# EAGLE design Satyrr_six_loadcell_pcb (EAGLE 9.6.2)

## Sheet 1 of 6
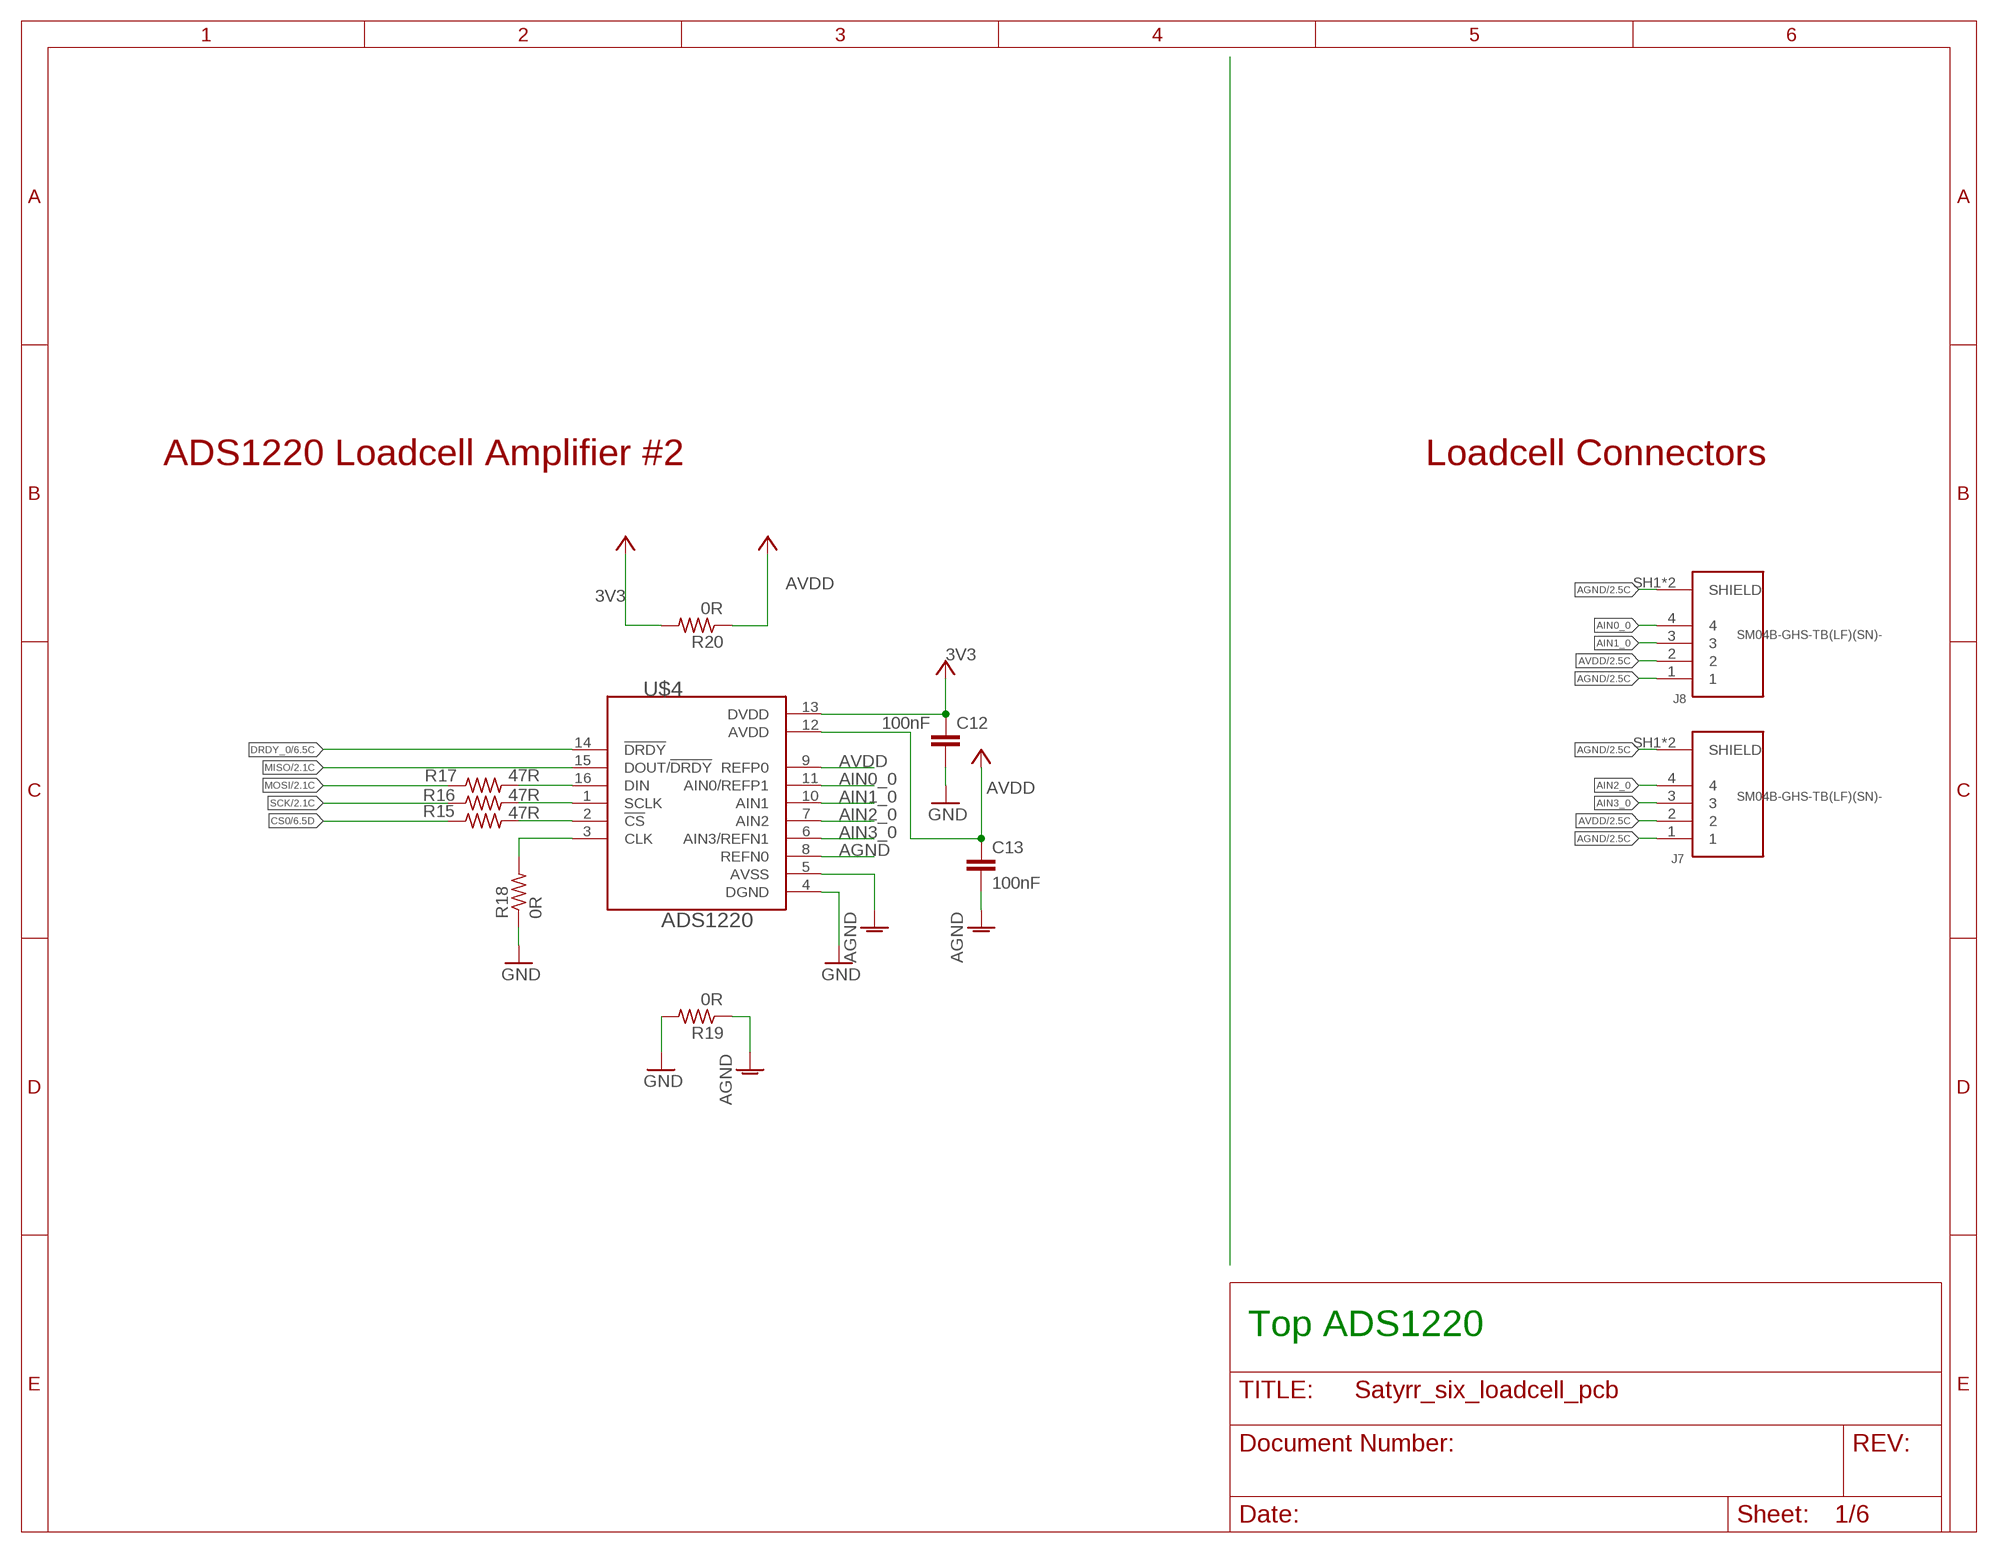
[diagram p0: schematic, sheet 1]

### Parts
C12  100nF  C-EUC0603  [C0603]
C13  100nF  C-EUC0603  [C0603]
J7  SM04B-GHS-TB(LF)(SN)-  [JST_SM04B-GHS-TB(LF)(SN)-]
J8  SM04B-GHS-TB(LF)(SN)-  [JST_SM04B-GHS-TB(LF)(SN)-]
R15  47R  R-US_R0603  [R0603]
R16  47R  R-US_R0603  [R0603]
R17  47R  R-US_R0603  [R0603]
R18  0R  R-US_R0603  [R0603]
R19  0R  R-US_R0603  [R0603]
R20  0R  R-US_R0603  [R0603]
U$4  ADS1220  [TSSOP-16]

### Nets
3V3: C12.1 R20.2 U$4.13(DVDD) ; supply symbol labelled VCC ; also sheet 2,3,4,5,6
AGND: C13.2 J7.1 J7.SH1(SHIELD) J7.SH2(SHIELD) J8.1 J8.SH1(SHIELD) J8.SH2(SHIELD) R19.1 U$4.5(AVSS) U$4.8(REFN0) ; also sheet 2,3
AIN0_0: J8.4 U$4.11(AIN0/REFP1)
AIN1_0: J8.3 U$4.10(AIN1)
AIN2_0: J7.4 U$4.7(AIN2)
AIN3_0: J7.3 U$4.6(AIN3/REFN1)
AVDD: C13.1 J7.2 J8.2 R20.1 U$4.9(REFP0) U$4.12(AVDD) ; supply symbol labelled +5V ; also sheet 2,3
CS0: R15.1 ; also sheet 6
DRDY_0: U$4.14(!DRDY) ; also sheet 6
GND: C12.2 R18.1 R19.2 U$4.4(DGND) ; also sheet 2,3,4,5,6
MISO: U$4.15(DOUT/!DRDY) ; also sheet 2,3,6
MOSI: R17.1 ; also sheet 2,3,6
N$9: R17.2 U$4.16(DIN)
N$10: R16.2 U$4.1(SCLK)
N$11: R15.2 U$4.2(!CS)
N$17: R18.2 U$4.3(CLK)
SCK: R16.1 ; also sheet 2,3,6

### Notes on the sheet
- ADS1220 Loadcell Amplifier #2 | Loadcell Connectors
- Top ADS1220

## Sheet 2 of 6
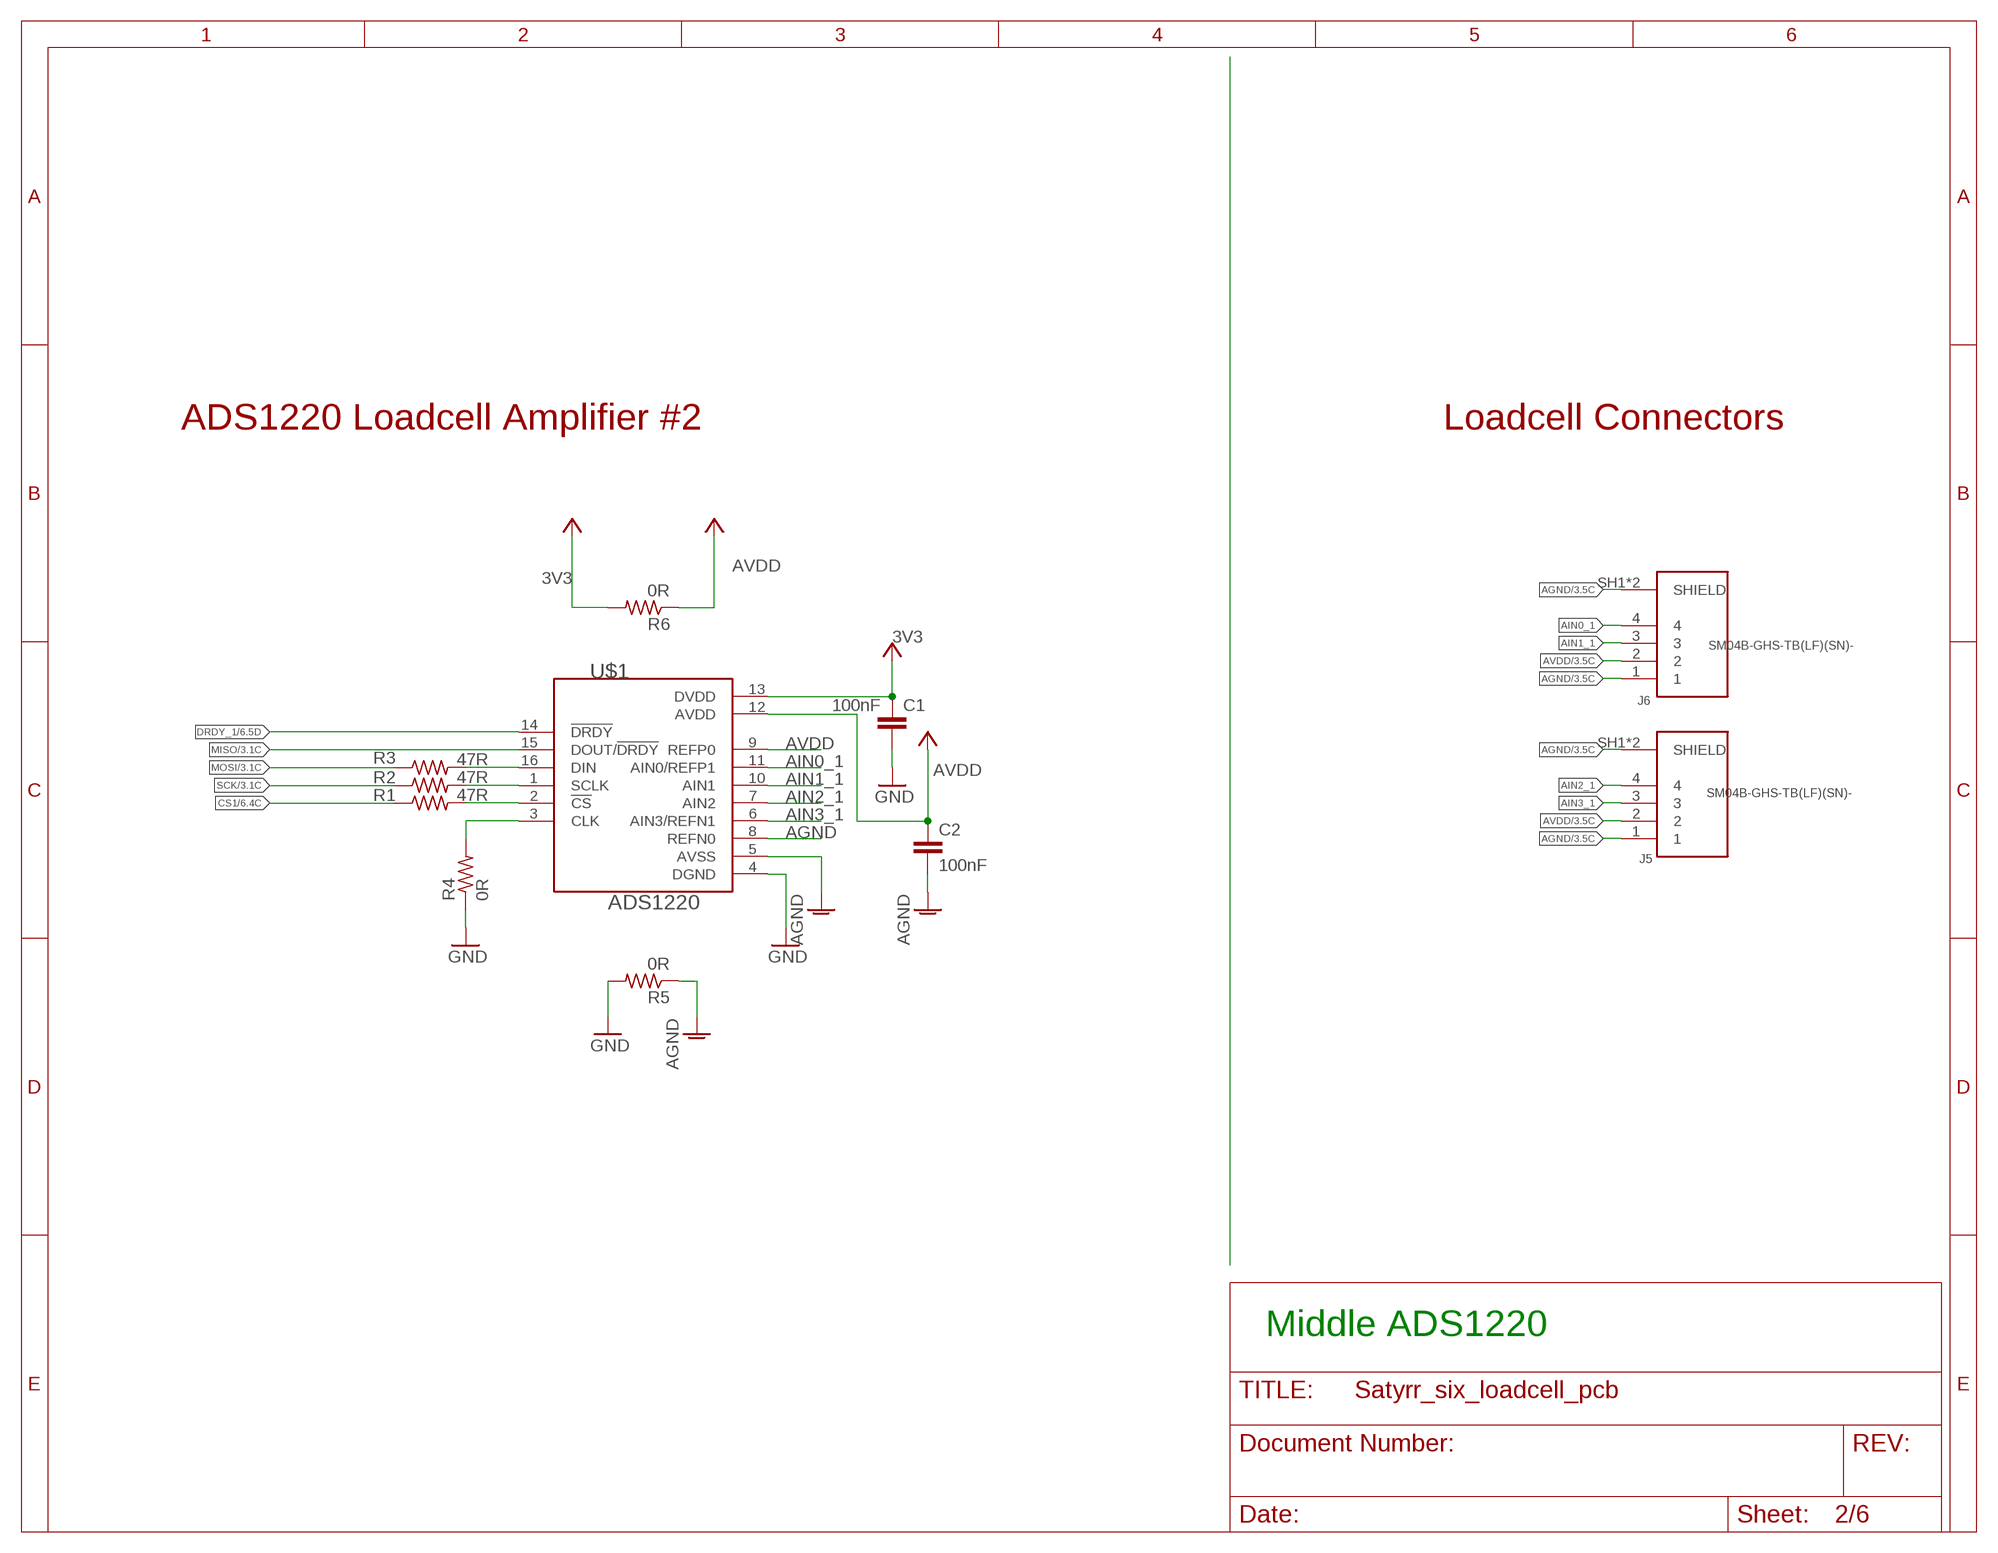
[diagram p1: schematic, sheet 2]

### Parts
C1  100nF  C-EUC0603  [C0603]
C2  100nF  C-EUC0603  [C0603]
J5  SM04B-GHS-TB(LF)(SN)-  [JST_SM04B-GHS-TB(LF)(SN)-]
J6  SM04B-GHS-TB(LF)(SN)-  [JST_SM04B-GHS-TB(LF)(SN)-]
R1  47R  R-US_R0603  [R0603]
R2  47R  R-US_R0603  [R0603]
R3  47R  R-US_R0603  [R0603]
R4  0R  R-US_R0603  [R0603]
R5  0R  R-US_R0603  [R0603]
R6  0R  R-US_R0603  [R0603]
U$1  ADS1220  [TSSOP-16]

### Nets
3V3: C1.1 R6.2 U$1.13(DVDD) ; supply symbol labelled VCC ; also sheet 1,3,4,5,6
AGND: C2.2 J5.1 J5.SH1(SHIELD) J5.SH2(SHIELD) J6.1 J6.SH1(SHIELD) J6.SH2(SHIELD) R5.1 U$1.5(AVSS) U$1.8(REFN0) ; also sheet 1,3
AIN0_1: J6.4 U$1.11(AIN0/REFP1)
AIN1_1: J6.3 U$1.10(AIN1)
AIN2_1: J5.4 U$1.7(AIN2)
AIN3_1: J5.3 U$1.6(AIN3/REFN1)
AVDD: C2.1 J5.2 J6.2 R6.1 U$1.9(REFP0) U$1.12(AVDD) ; supply symbol labelled +5V ; also sheet 1,3
CS1: R1.1 ; also sheet 6
DRDY_1: U$1.14(!DRDY) ; also sheet 6
GND: C1.2 R4.1 R5.2 U$1.4(DGND) ; also sheet 1,3,4,5,6
MISO: U$1.15(DOUT/!DRDY) ; also sheet 1,3,6
MOSI: R3.1 ; also sheet 1,3,6
N$3: R3.2 U$1.16(DIN)
N$4: R2.2 U$1.1(SCLK)
N$5: R1.2 U$1.2(!CS)
N$7: R4.2 U$1.3(CLK)
SCK: R2.1 ; also sheet 1,3,6

### Notes on the sheet
- ADS1220 Loadcell Amplifier #2 | Loadcell Connectors
- Middle ADS1220

## Sheet 3 of 6
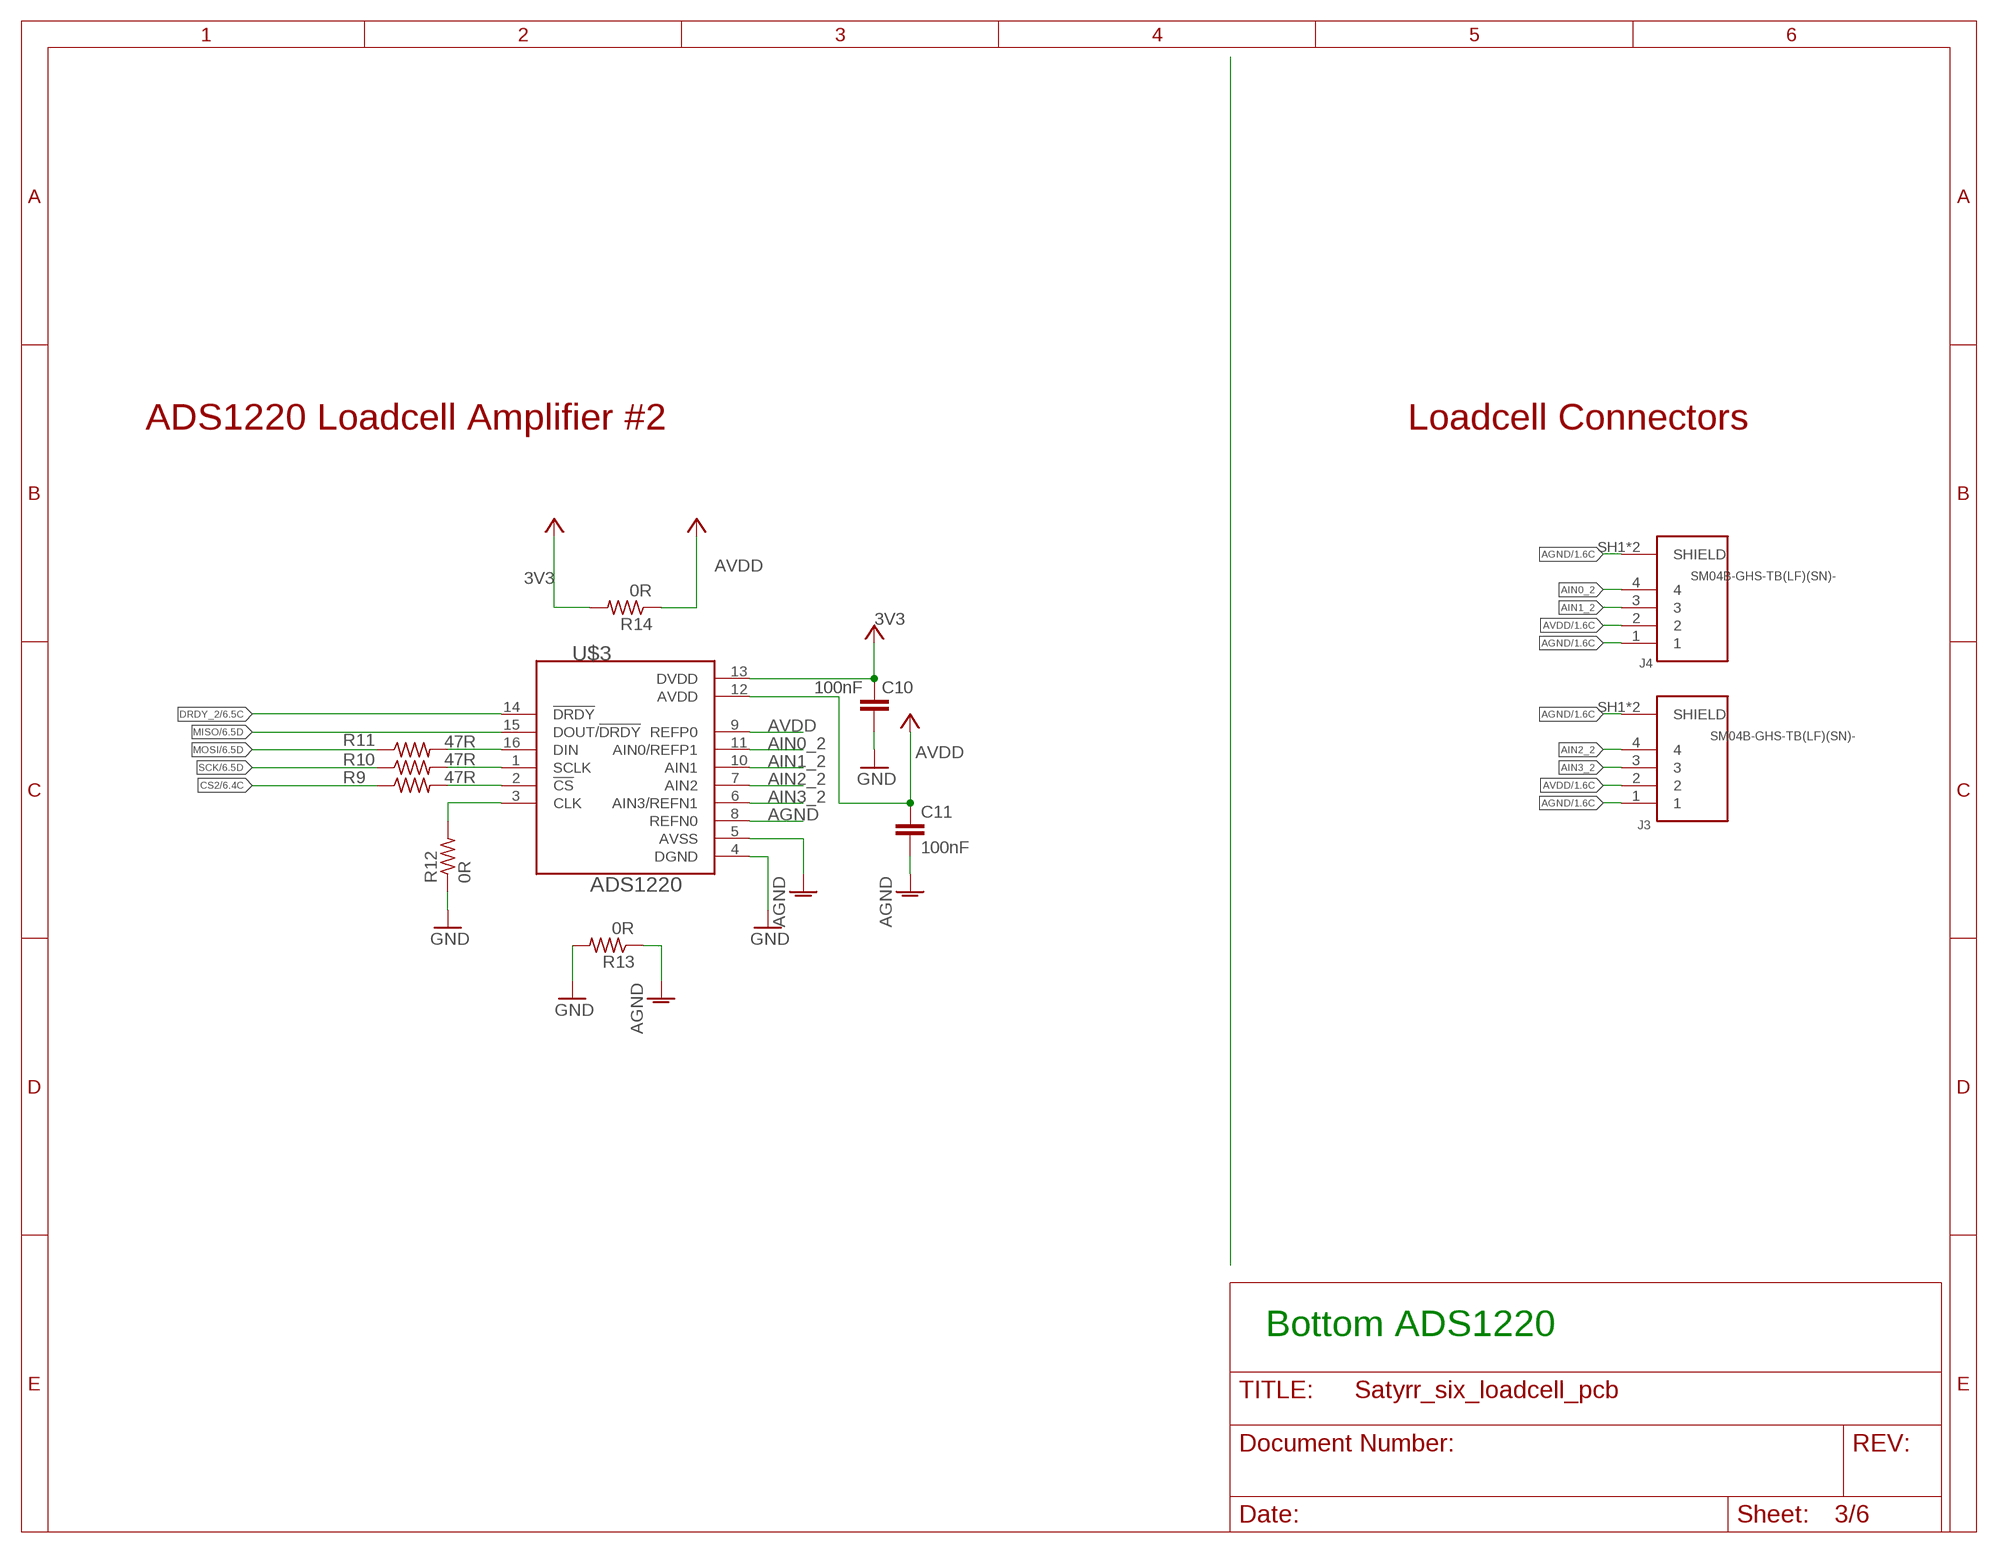
[diagram p2: schematic, sheet 3]

### Parts
C10  100nF  C-EUC0603  [C0603]
C11  100nF  C-EUC0603  [C0603]
J3  SM04B-GHS-TB(LF)(SN)-  [JST_SM04B-GHS-TB(LF)(SN)-]
J4  SM04B-GHS-TB(LF)(SN)-  [JST_SM04B-GHS-TB(LF)(SN)-]
R9  47R  R-US_R0603  [R0603]
R10  47R  R-US_R0603  [R0603]
R11  47R  R-US_R0603  [R0603]
R12  0R  R-US_R0603  [R0603]
R13  0R  R-US_R0603  [R0603]
R14  0R  R-US_R0603  [R0603]
U$3  ADS1220  [TSSOP-16]

### Nets
3V3: C10.1 R14.2 U$3.13(DVDD) ; supply symbol labelled VCC ; also sheet 1,2,4,5,6
AGND: C11.2 J3.1 J3.SH1(SHIELD) J3.SH2(SHIELD) J4.1 J4.SH1(SHIELD) J4.SH2(SHIELD) R13.1 U$3.5(AVSS) U$3.8(REFN0) ; also sheet 1,2
AIN0_2: J4.4 U$3.11(AIN0/REFP1)
AIN1_2: J4.3 U$3.10(AIN1)
AIN2_2: J3.4 U$3.7(AIN2)
AIN3_2: J3.3 U$3.6(AIN3/REFN1)
AVDD: C11.1 J3.2 J4.2 R14.1 U$3.9(REFP0) U$3.12(AVDD) ; supply symbol labelled +5V ; also sheet 1,2
CS2: R9.1 ; also sheet 6
DRDY_2: U$3.14(!DRDY) ; also sheet 6
GND: C10.2 R12.1 R13.2 U$3.4(DGND) ; also sheet 1,2,4,5,6
MISO: U$3.15(DOUT/!DRDY) ; also sheet 1,2,6
MOSI: R11.1 ; also sheet 1,2,6
N$1: R11.2 U$3.16(DIN)
N$2: R10.2 U$3.1(SCLK)
N$6: R9.2 U$3.2(!CS)
N$8: R12.2 U$3.3(CLK)
SCK: R10.1 ; also sheet 1,2,6

### Notes on the sheet
- ADS1220 Loadcell Amplifier #2 | Loadcell Connectors
- Bottom ADS1220

## Sheet 4 of 6
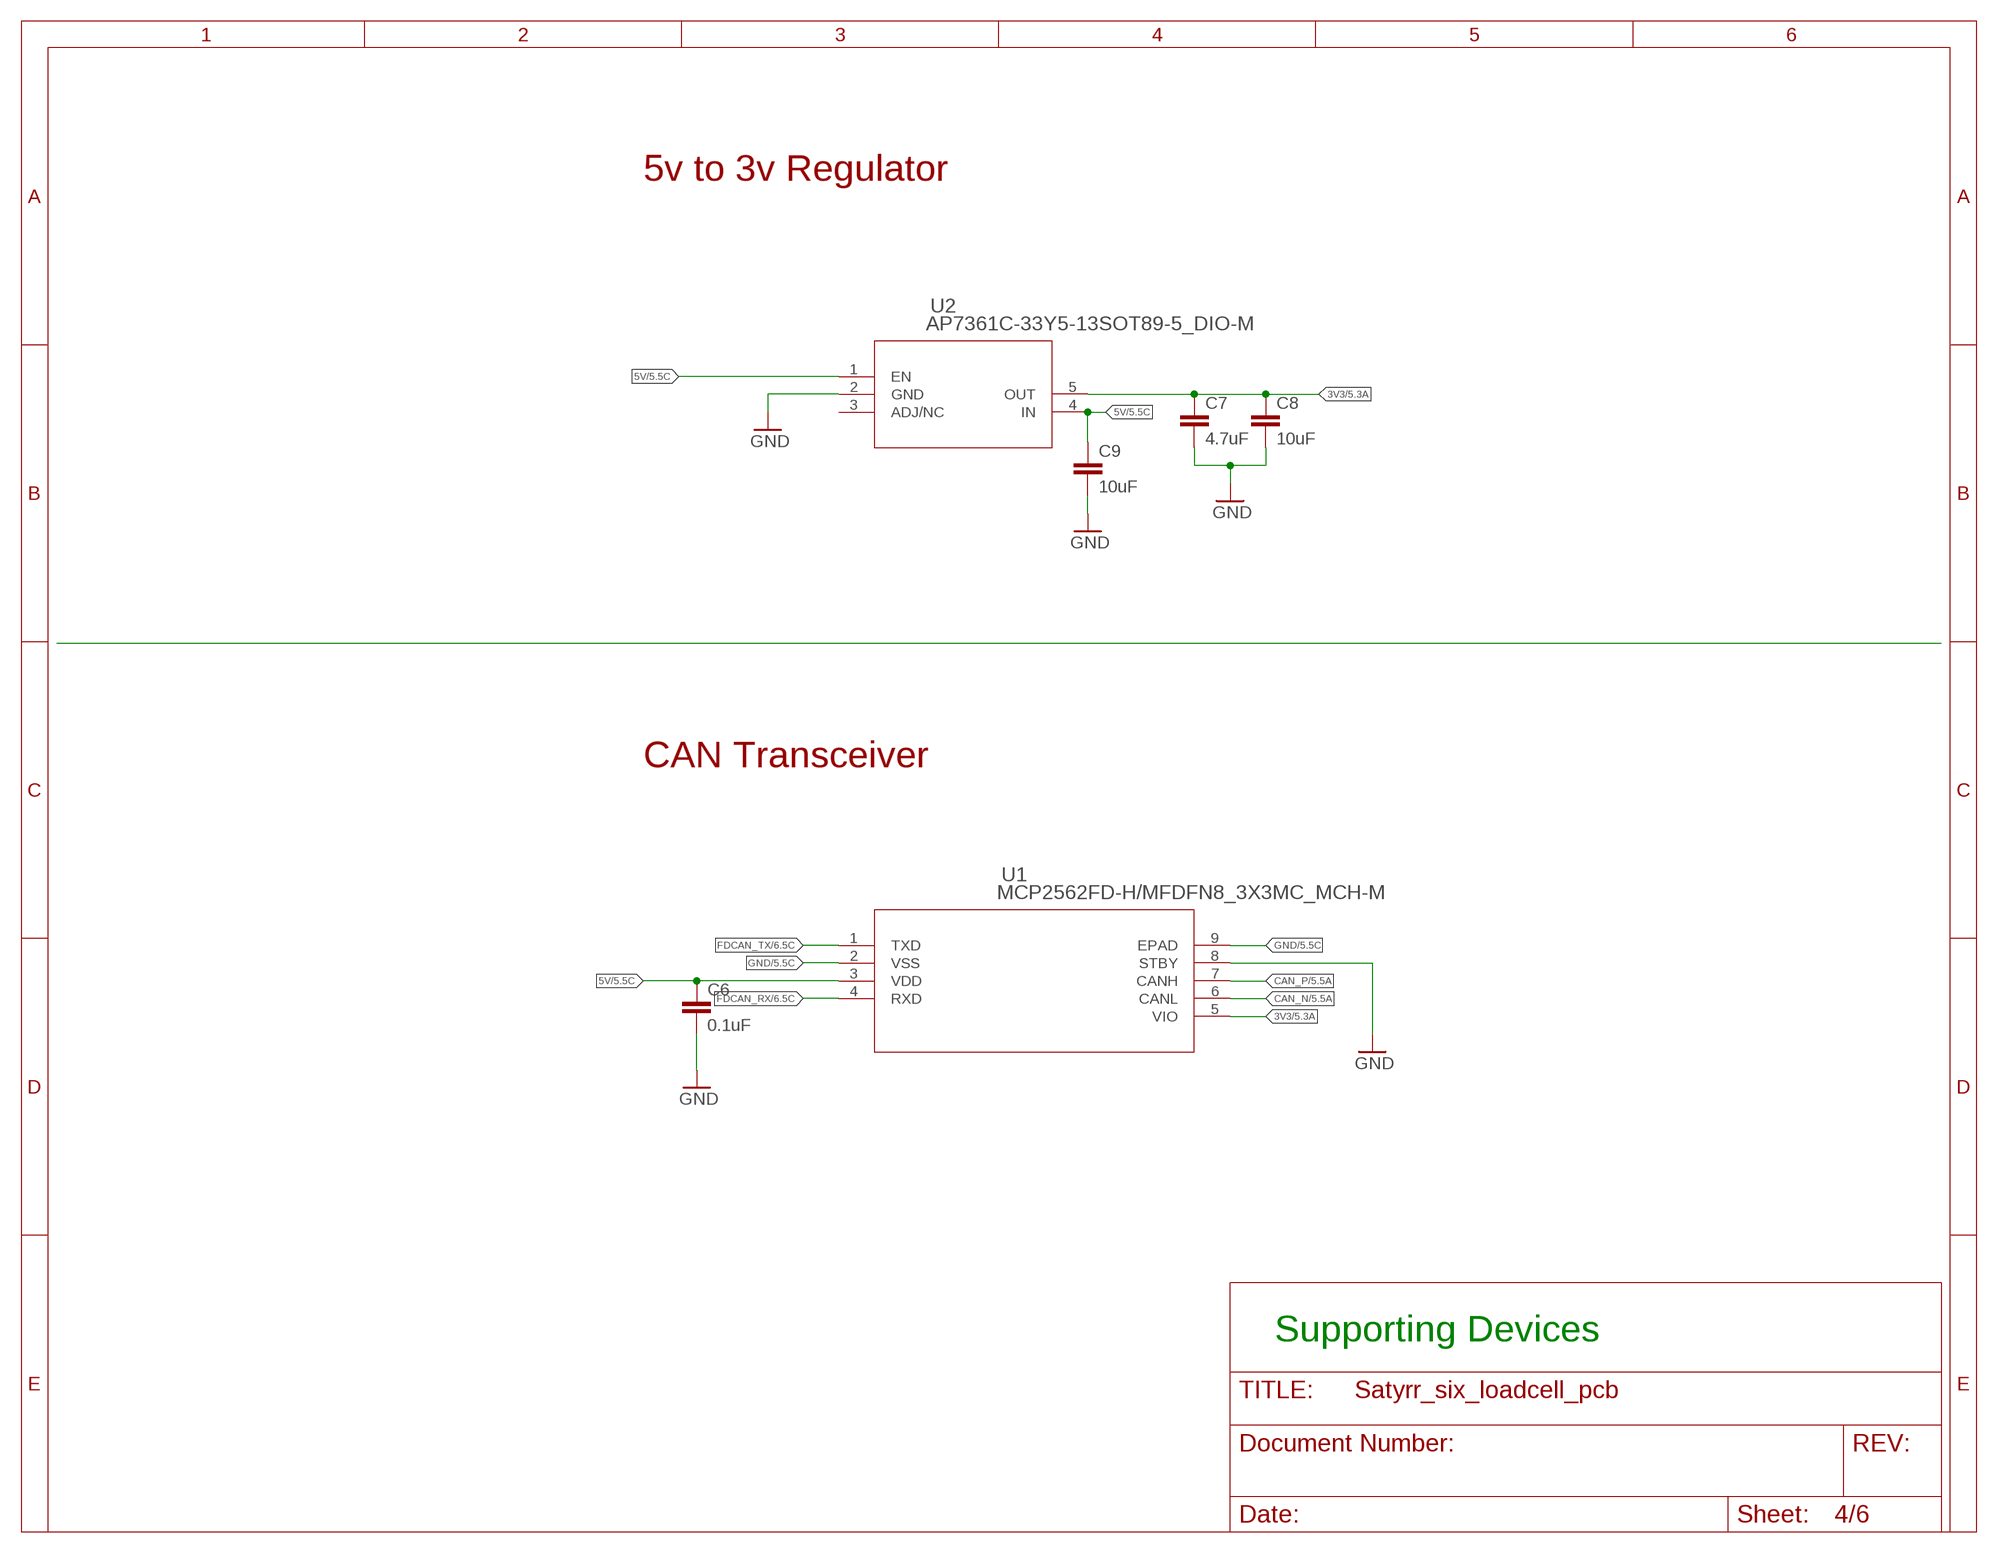
[diagram p3: schematic, sheet 4]

### Parts
C6  0.1uF  C-EUC0603  [C0603]
C7  4.7uF  C-EUC0603  [C0603]
C8  10uF  C-EUC0603  [C0603]
C9  10uF  C-EUC0603  [C0603]
U1  MCP2562FD-H/MFDFN8_3X3MC_MCH-M  [DFN8_3X3MC_MCH-M]
U2  AP7361C-33Y5-13SOT89-5_DIO-M  [SOT89-5_DIO-M]

### Nets
3V3: C7.1 C8.1 U1.5(VIO) U2.5(OUT) ; also sheet 1,2,3,5,6
5V: C6.1 C9.1 U1.3(VDD) U2.1(EN) U2.4(IN) ; also sheet 5
CAN_N: U1.6(CANL) ; also sheet 5
CAN_P: U1.7(CANH) ; also sheet 5
FDCAN_RX: U1.4(RXD) ; also sheet 6
FDCAN_TX: U1.1(TXD) ; also sheet 6
GND: C6.2 C7.2 C8.2 C9.2 U1.2(VSS) U1.8(STBY) U1.9(EPAD) U2.2(GND) ; also sheet 1,2,3,5,6
Unconnected: U2.3(ADJ/NC)

### Notes on the sheet
- 5v to 3v Regulator
- CAN Transceiver
- Supporting Devices

## Sheet 5 of 6
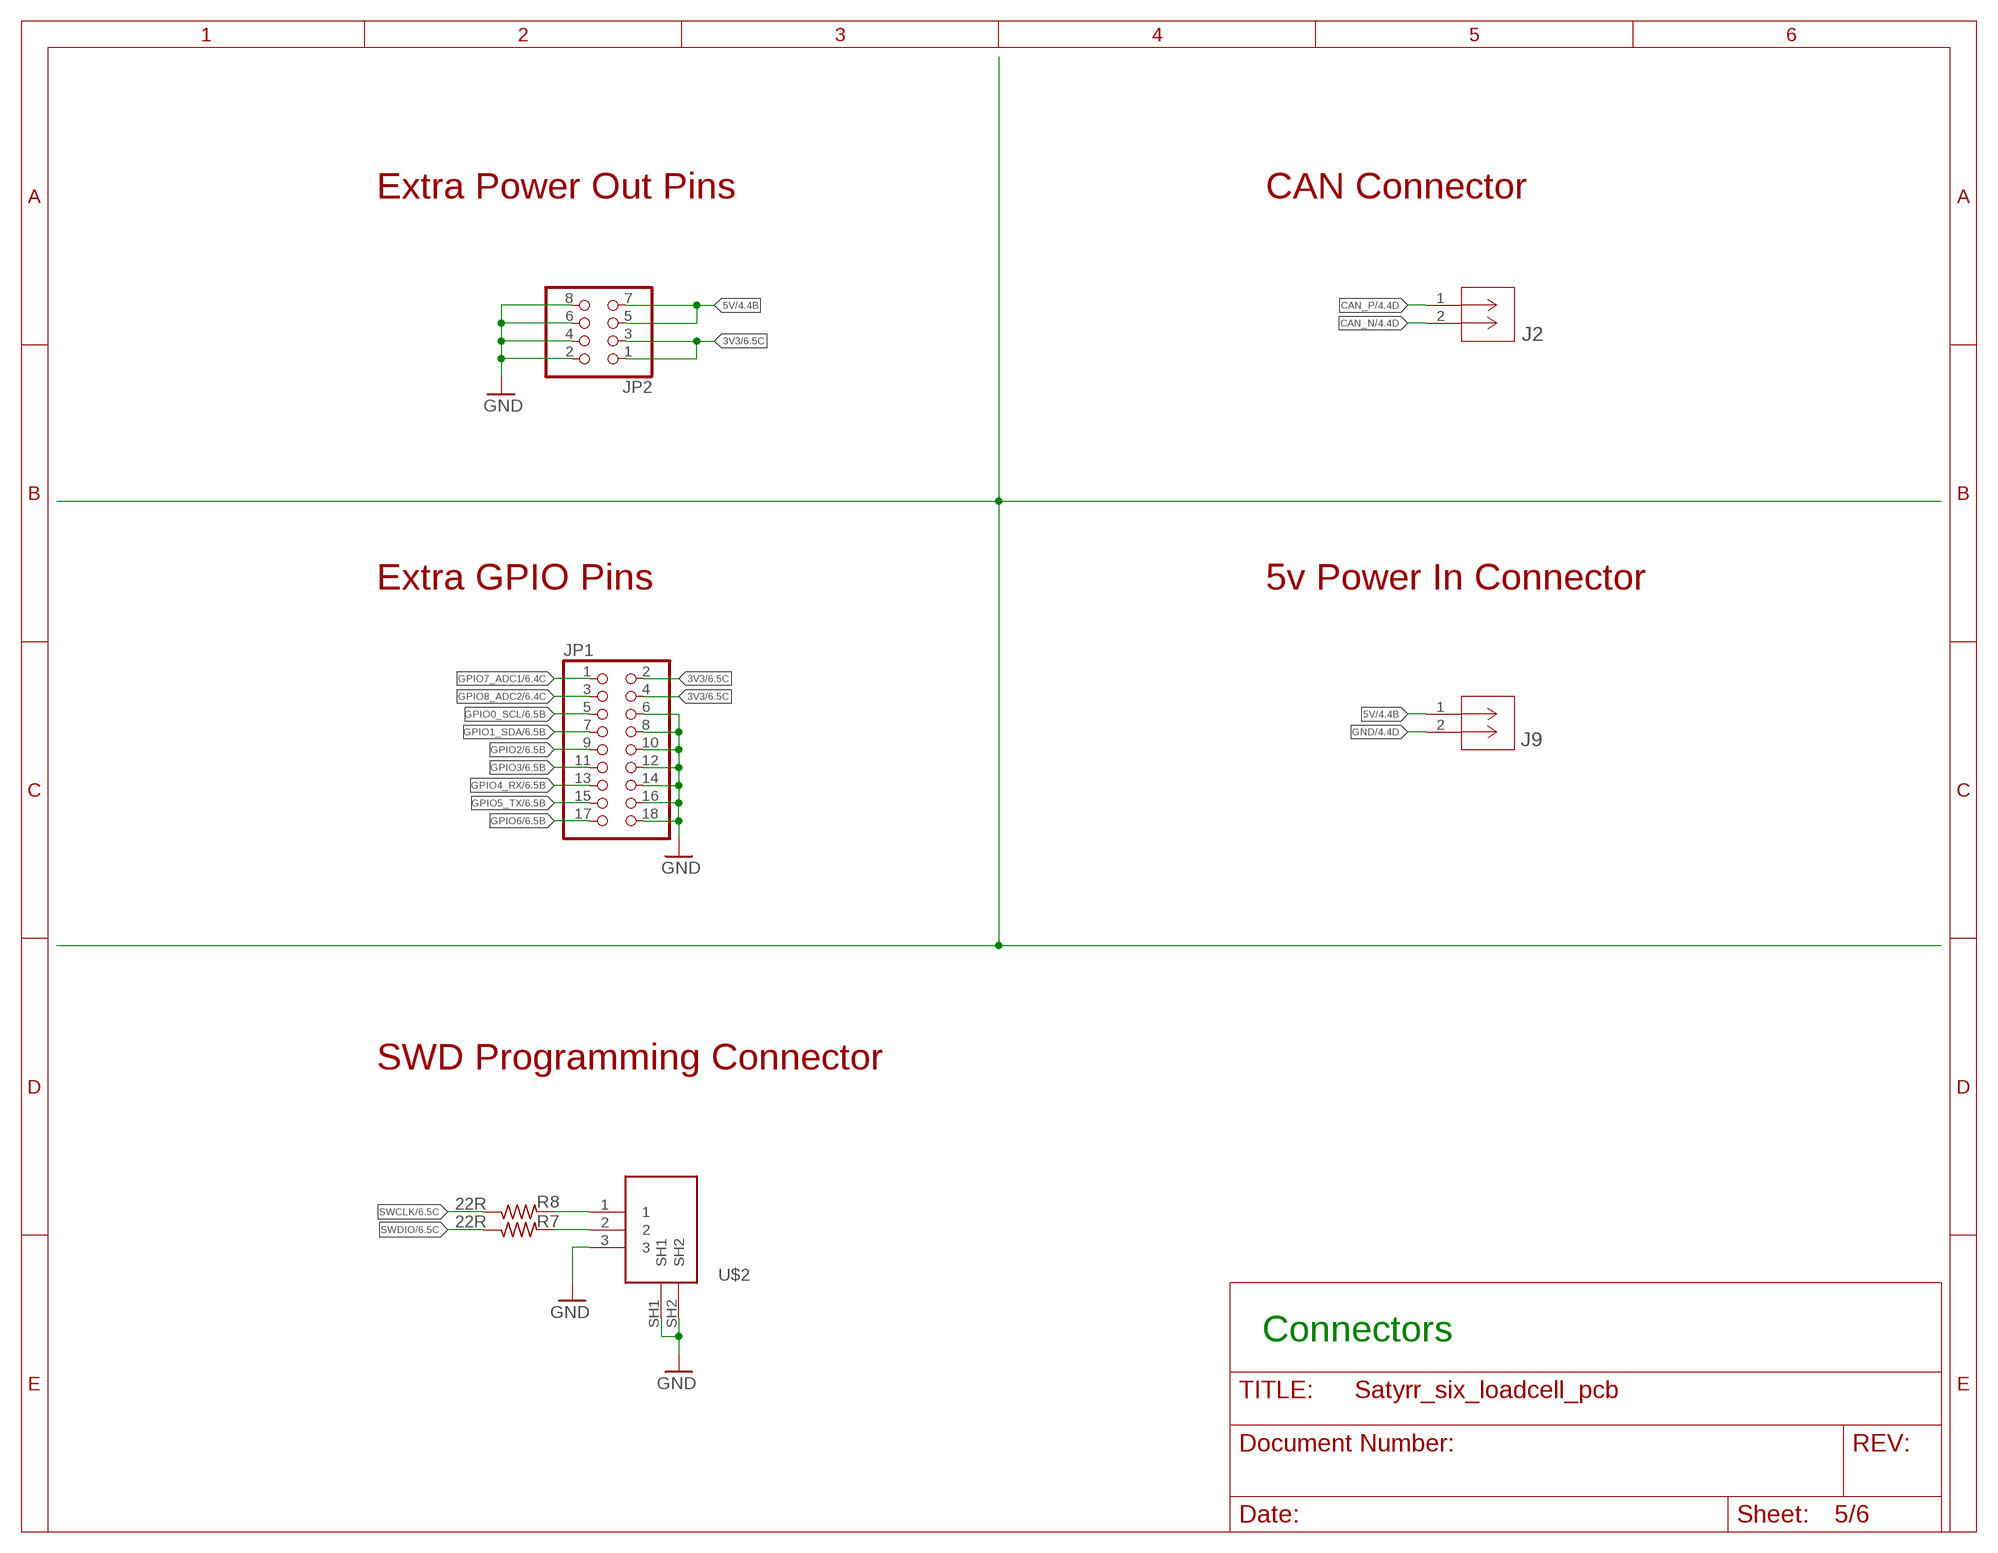
[diagram p4: schematic, sheet 5]

### Parts
J2  SM02BGHSTBLFSN  [CONN_SM02BGHSTB_JST]
J9  22057025  [CON_22057025_MOL]
JP1  PINHD-2X9  [2X09]
JP2  PINHD-2X4  [2X04]
R7  22R  R-US_R0603  [R0603]
R8  22R  R-US_R0603  [R0603]
U$2  125SH-G-03-TR-SMT  [125SH-G-03-TR-SMT]

### Nets
3V3: JP1.2 JP1.4 JP2.1 JP2.3 ; also sheet 1,2,3,4,6
5V: J9.1 JP2.5 JP2.7 ; also sheet 4
CAN_N: J2.2 ; also sheet 4
CAN_P: J2.1 ; also sheet 4
GND: J9.2 JP1.6 JP1.8 JP1.10 JP1.12 JP1.14 JP1.16 JP1.18 JP2.2 JP2.4 JP2.6 JP2.8 U$2.3 U$2.SH1 U$2.SH2 ; also sheet 1,2,3,4,6
GPIO0_SCL: JP1.5 ; also sheet 6
GPIO1_SDA: JP1.7 ; also sheet 6
GPIO2: JP1.9 ; also sheet 6
GPIO3: JP1.11 ; also sheet 6
GPIO4_RX: JP1.13 ; also sheet 6
GPIO5_TX: JP1.15 ; also sheet 6
GPIO6: JP1.17 ; also sheet 6
GPIO7_ADC1: JP1.1 ; also sheet 6
GPIO8_ADC2: JP1.3 ; also sheet 6
SWCLK: R8.1 ; also sheet 6
SWCLK_C: R8.2 U$2.1
SWDIO: R7.1 ; also sheet 6
SWDIO_C: R7.2 U$2.2

### Notes on the sheet
- Extra Power Out Pins | CAN Connector
- Extra GPIO Pins | 5v Power In Connector
- SWD Programming Connector
- U$2
- Connectors

## Sheet 6 of 6
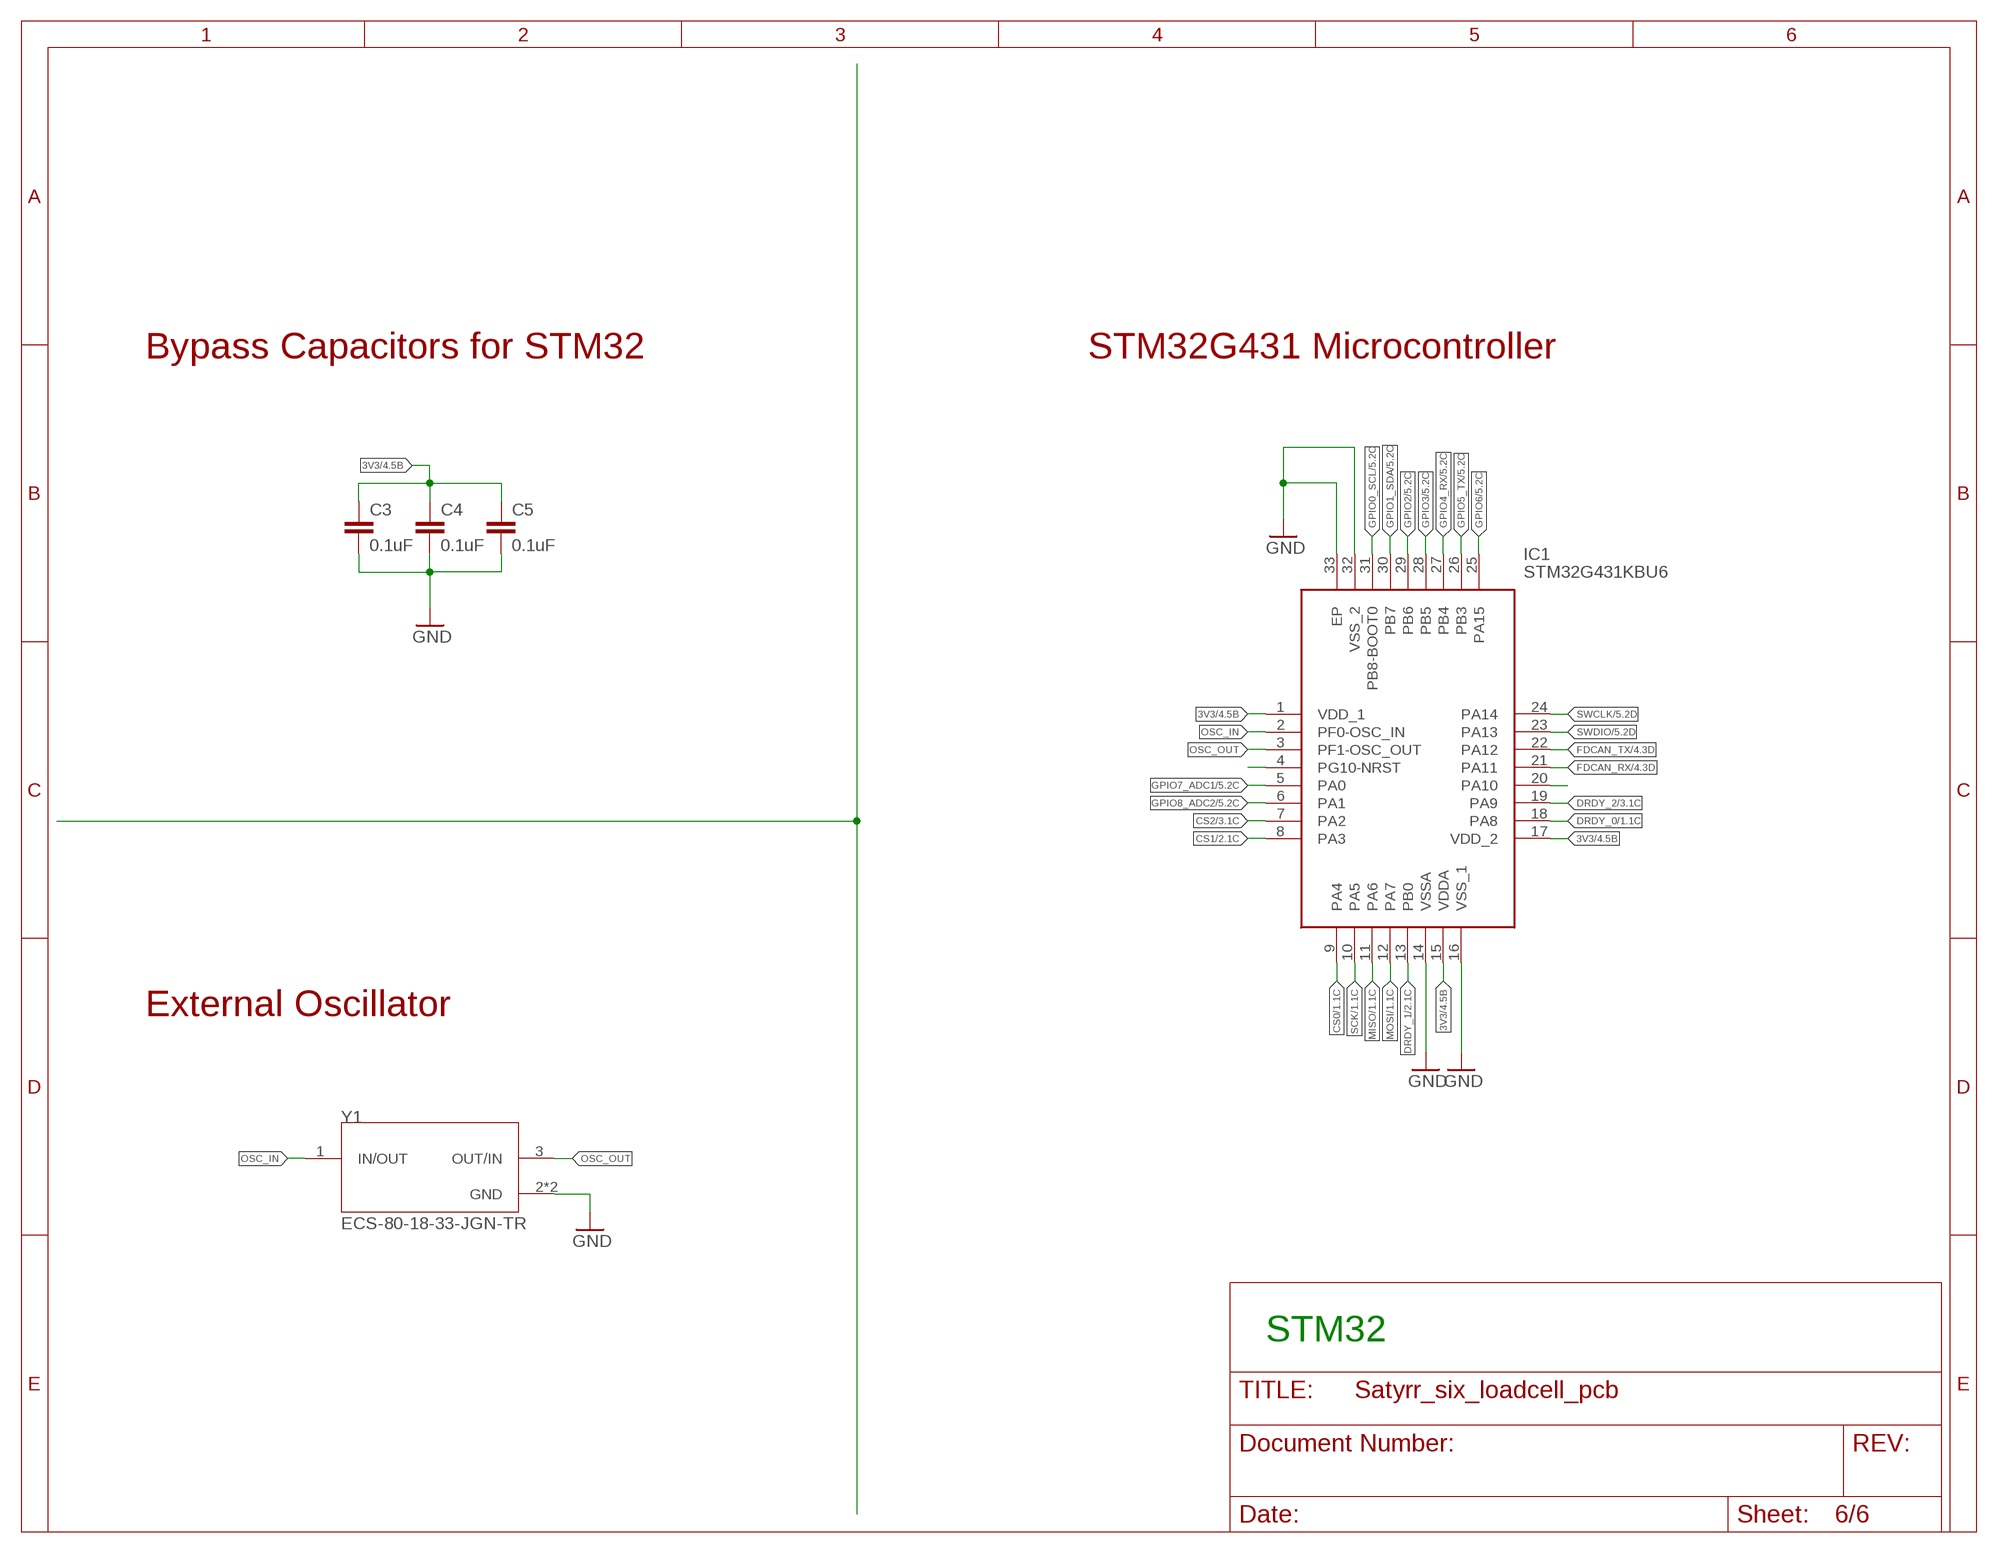
[diagram p5: schematic, sheet 6]

### Parts
C3  0.1uF  C-EUC0603  [C0603]
C4  0.1uF  C-EUC0603  [C0603]
C5  0.1uF  C-EUC0603  [C0603]
IC1  STM32G431KBU6  [QFN50P500X500X60-33N]
Y1  ECS-80-18-33-JGN-TR  [XTAL_ECS-240-8-33-AGN-TR]

### Nets
3V3: C3.1 C4.1 C5.1 IC1.1(VDD_1) IC1.15(VDDA) IC1.17(VDD_2) ; also sheet 1,2,3,4,5
CS0: IC1.9(PA4) ; also sheet 1
CS1: IC1.8(PA3) ; also sheet 2
CS2: IC1.7(PA2) ; also sheet 3
DRDY_0: IC1.18(PA8) ; also sheet 1
DRDY_1: IC1.13(PB0) ; also sheet 2
DRDY_2: IC1.19(PA9) ; also sheet 3
FDCAN_RX: IC1.21(PA11) ; also sheet 4
FDCAN_TX: IC1.22(PA12) ; also sheet 4
GND: C3.2 C4.2 C5.2 IC1.14(VSSA) IC1.16(VSS_1) IC1.32(VSS_2) IC1.33(EP) Y1.2(GND) Y1.4(GND) ; also sheet 1,2,3,4,5
GPIO0_SCL: IC1.31(PB8-BOOT0) ; also sheet 5
GPIO1_SDA: IC1.30(PB7) ; also sheet 5
GPIO2: IC1.29(PB6) ; also sheet 5
GPIO3: IC1.28(PB5) ; also sheet 5
GPIO4_RX: IC1.27(PB4) ; also sheet 5
GPIO5_TX: IC1.26(PB3) ; also sheet 5
GPIO6: IC1.25(PA15) ; also sheet 5
GPIO7_ADC1: IC1.5(PA0) ; also sheet 5
GPIO8_ADC2: IC1.6(PA1) ; also sheet 5
MISO: IC1.11(PA6) ; also sheet 1,2,3
MOSI: IC1.12(PA7) ; also sheet 1,2,3
N$12: IC1.4(PG10-NRST)
N$28: IC1.20(PA10)
OSC_IN: IC1.2(PF0-OSC_IN) Y1.1(IN/OUT)
OSC_OUT: IC1.3(PF1-OSC_OUT) Y1.3(OUT/IN)
SCK: IC1.10(PA5) ; also sheet 1,2,3
SWCLK: IC1.24(PA14) ; also sheet 5
SWDIO: IC1.23(PA13) ; also sheet 5

### Notes on the sheet
- Bypass Capacitors for STM32 | STM32G431 Microcontroller
- External Oscillator
- STM32

## Library data of the parts
C1-C13 = rcl:C-EU: CAPACITOR, European symbol; SPICEPREFIX: C
IC1 = STM32G431KBU6:STM32G431KBU6: STMICROELECTRONICS - STM32G431KBU6 - MCU, 32BIT, 170MHZ, UFQFPN-32 Source: Datasheet <https://www.st.com/resource/en/datasheet/stm32g431kb.pdf>; ARROW_PART_NUMBER: STM32G431KBU6; ARROW_PRICE-STOCK: https://www.arrow.com/en/products/stm32g431kbu6/stmicroelectronics?region=nac; DESCRIPTION: STMICROELECTRONICS - STM32G431KBU6 - MCU, 32BIT, 170MHZ, UFQFPN-32; HEIGHT: 0.6mm; MANUFACTURER_NAME: STMicroelectronics; MANUFACTURER_PART_NUMBER: STM32G431KBU6; MOUSER_PART_NUMBER: 511-STM32G431KBU6; MOUSER_PRICE-STOCK: https://www.mouser.co.uk/ProductDetail/STMicroelectronics/STM32G431KBU6?qs=T3oQrply3y%2Frk9w4R%2FCLxg%3D%3D
J2 = SM02B-GHS-TB:SM02BGHSTBLFSN; COPYRIGHT: Copyright (C) 2022 Ultra Librarian. All rights reserved.; DIGI-KEY_PART_NUMBER_1: 455-1564-2-ND; DIGI-KEY_PART_NUMBER_2: 455-1564-1-ND; DIGI-KEY_PART_NUMBER_3: 455-1564-6-ND; MANUFACTURER_PART_NUMBER: SM02BGHSTBLFSN; MFR_NAME: JST
J3-J8 = SM04B-GHS-TB_LF__SN_-:SM04B-GHS-TB(LF)(SN)-: Conn Header Gh Side 4pos 1.25mm; DESCRIPTION: Connector Header Surface Mount, Right Angle 4 position 0.049 (1.25mm); DIGI-KEY_PART_NUMBER: 455-1566-2-ND; MF: JST Sales; MP: SM04B-GHS-TB(LF)(SN)-; PACKAGE: None; PURCHASE-URL: https://pricing.snapeda.com/search/part/SM04B-GHS-TB(LF)(SN)-/?ref=eda
J9 = loadcell_amp:22057025; COPYRIGHT: Copyright (C) 2023 Ultra Librarian. All rights reserved.; MANUFACTURER_PART_NUMBER: 22057025; MFR_NAME: Molex Connector Corporation
JP1 = pinhead:PINHD-2X9: PIN HEADER
JP2 = pinhead:PINHD-2X4: PIN HEADER
R1-R20 = rcl:R-US_: RESISTOR, American symbol; SPICEPREFIX: R
U1 = MCP2562FD:MCP2562FD-H/MF; COPYRIGHT: Copyright (C) 2023 Ultra Librarian. All rights reserved.; MANUFACTURER_PART_NUMBER: MCP2562FD-H/MF; MFR_NAME: Microchip
U2 = AP7361C-33Y5-13:AP7361C-33Y5-13; COPYRIGHT: Copyright (C) 2023 Ultra Librarian. All rights reserved.; MANUFACTURER_PART_NUMBER: AP7361C-33Y5-13; MFR_NAME: Diodes Inc
U$1 U$3 U$4 = circuitects:ADS1220
U$2 = 125SH-G-03-TR-SMT:125SH-G-03-TR-SMT
Y1 = ECS-80-18-33-JGN-TR:ECS-80-18-33-JGN-TR: The sub miniature ECX-32 is a compact SMD Crystal. The 3.2 x 2.5 x 0.8 mm ceramic package is ideal for today’s SMD manufacturing environment.; AVAILABILITY: Good; DESCRIPTION: The sub miniature ECX-32 is a compact SMD Crystal.; MF: ECS INC; MP: ECX-32; PACKAGE: SMD-4 ECX; STANDARD: Manufacturer recommendations

## Board
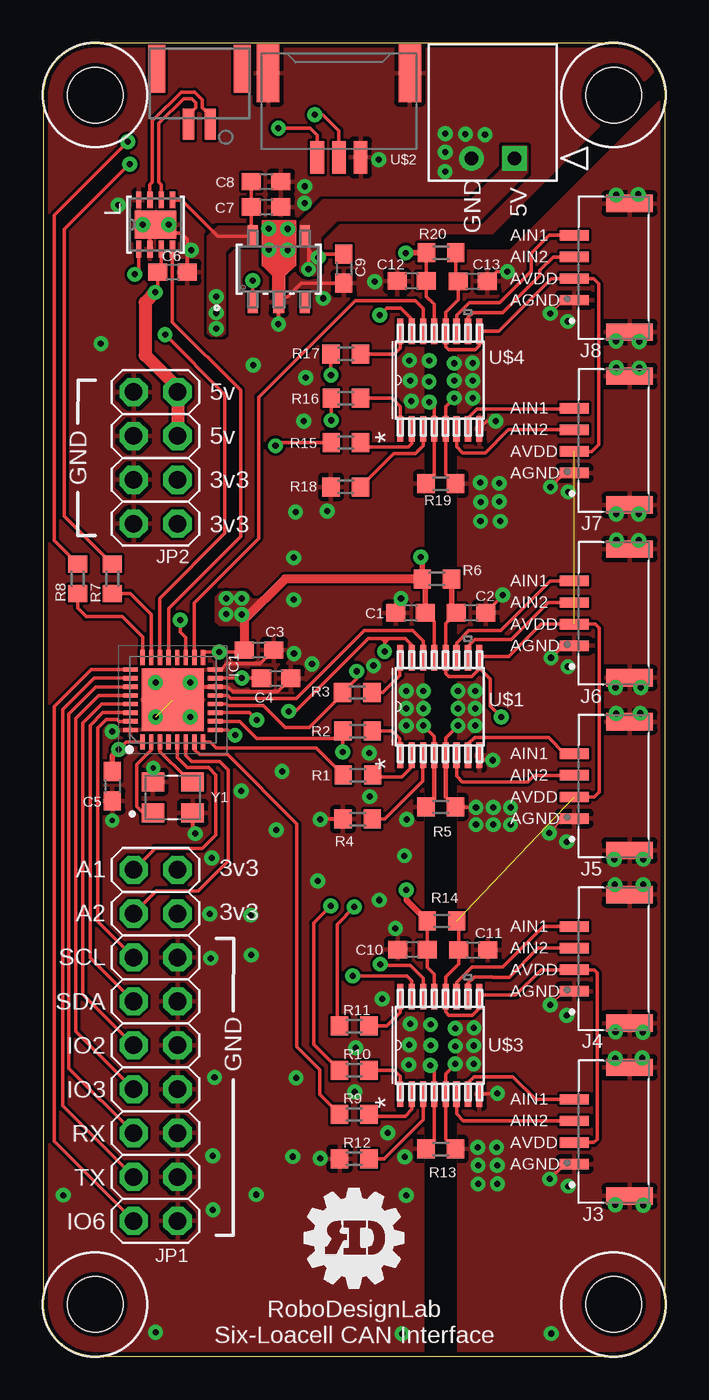
[diagram p6: board, top side]
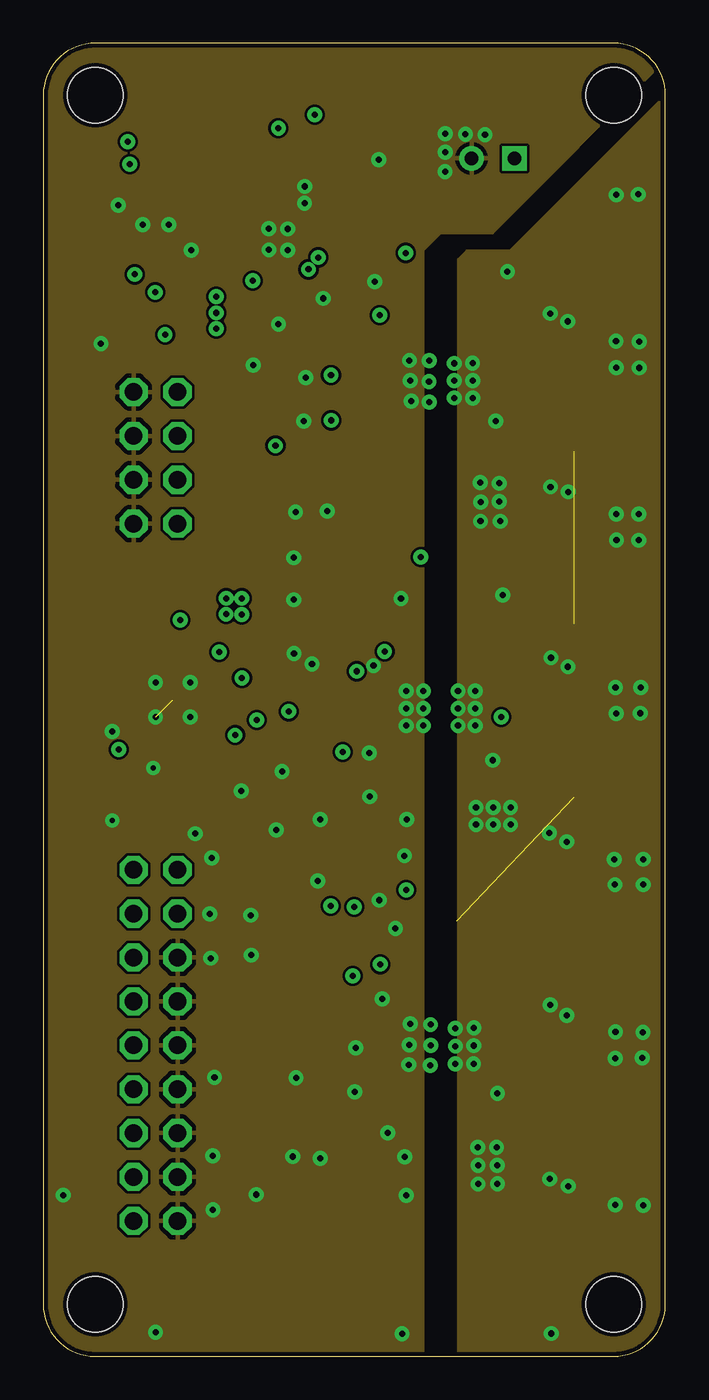
[diagram p7: board, inner layer Route2]
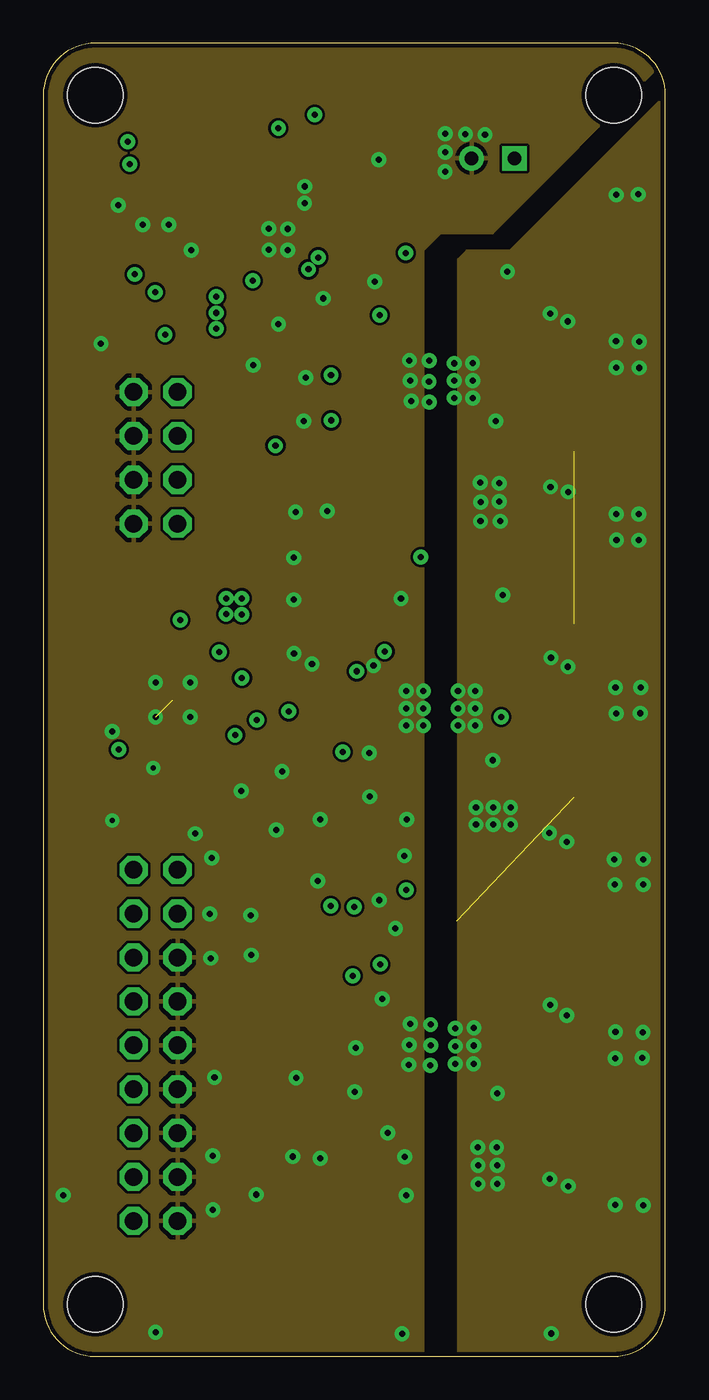
[diagram p8: board, inner layer Route15]
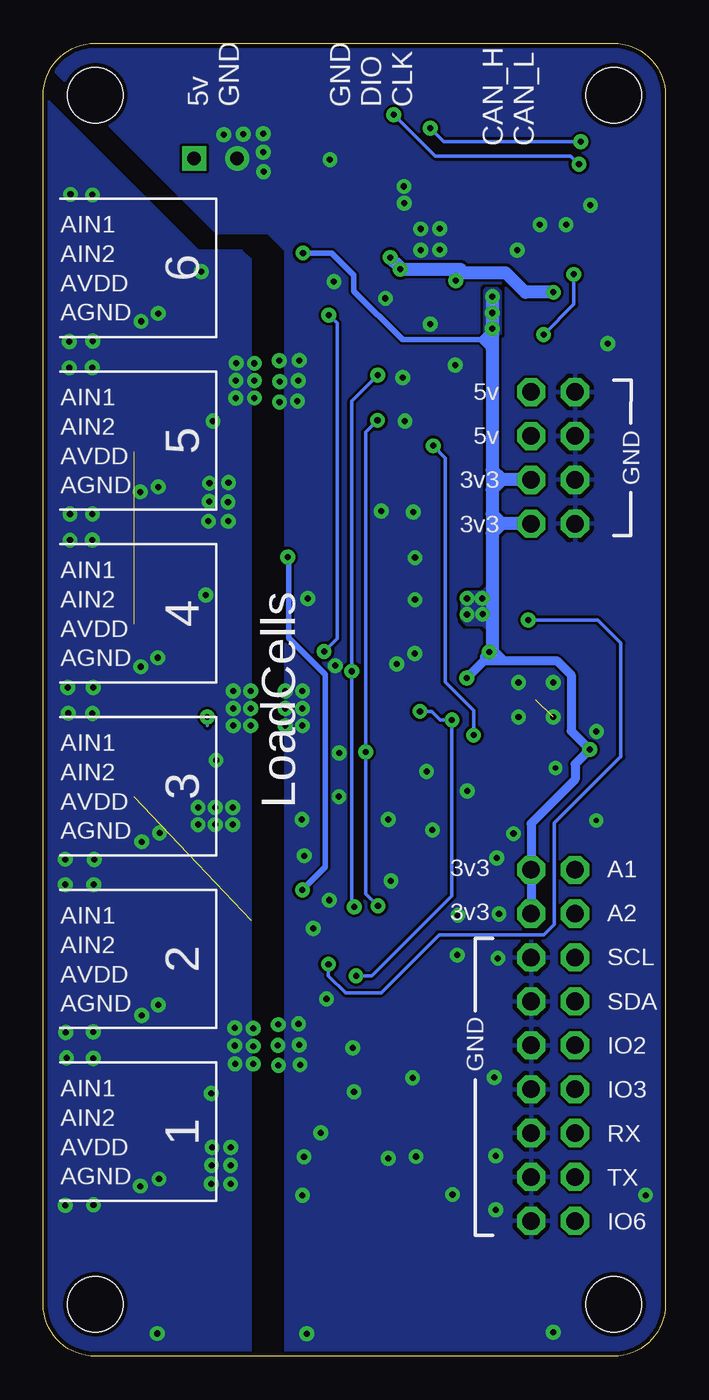
[diagram p9: board, bottom side, seen from below]

Size 36 x 76 mm. Coordinates in mm from the lower left corner, seen from the top.
Outline: 0,73 0,3 arc90 3,0 33,0 33.26,0.01 arc85 36,3 36,73 35.99,73.26 arc85 33,76 3,76 2.74,75.99 arc85 0,73
Copper layers (1+2*15+16): Top 0.035mm / dielectric 1.5mm / Route2 0.035mm / dielectric 0.15mm / Route15 0.035mm / dielectric 0.2mm / Bottom 0.035mm
Design rules "Circuitects-Rules *": minimum track width 6mil, minimum drill 0.3mm, track to track 6mil, track to pad 6mil, pad to pad 6mil, via to via 6mil, smd to smd 6mil, copper to edge 10mil, drill to drill 8mil, minimum pad ring 12mil, minimum via ring 10mil, stop-mask expansion 4mil, vias tented up to drill 25mil, thermal gap 10mil
Holes 3.2 mm at 33,3 3,3 33,73 3,73

### Footprints (pad centres in the part's own frame; a part is rotated, then mirrored left to right if it is on the bottom)
C0603 = smd 1.1 x 1: 1 -0.85,0; 2 0.85,0
QFN50P500X500X60-33N = smd 0.85 x 0.25: 1 -2.45,1.75; 2 -2.45,1.25; 3 -2.45,0.75; 4 -2.45,0.25; 5 -2.45,-0.25; 6 -2.45,-0.75; 7 -2.45,-1.25; 8 -2.45,-1.75; 17 2.45,-1.75; 18 2.45,-1.25; 19 2.45,-0.75; 20 2.45,-0.25; 21 2.45,0.25; 22 2.45,0.75; 23 2.45,1.25; 24 2.45,1.75 | smd 0.25 x 0.85: 9 -1.75,-2.45; 10 -1.25,-2.45; 11 -0.75,-2.45; 12 -0.25,-2.45; 13 0.25,-2.45; 14 0.75,-2.45; 15 1.25,-2.45; 16 1.75,-2.45; 25 1.75,2.45; 26 1.25,2.45; 27 0.75,2.45; 28 0.25,2.45; 29 -0.25,2.45; 30 -0.75,2.45; 31 -1.25,2.45; 32 -1.75,2.45 | smd 3.6 x 3.6: 33 0,0
CONN_SM02BGHSTB_JST = smd 0.66 x 1.803: 1 -0.625,2.345; 2 0.625,2.345 | smd 0.991 x 2.794: 3 -2.475,-0.865; 4 2.475,-0.865
JST_SM04B-GHS-TB(LF)(SN)- = smd 0.6 x 1.7: 1 -1.875,2.275; 2 -0.625,2.275; 3 0.625,2.275; 4 1.875,2.275 | smd 1 x 2.7: SH1 -3.725,-0.925; SH2 3.725,-0.925
CON_22057025_MOL = drill 0.787 pad 1.143 square: 1 0,0 | drill 0.787 pad 1.143: 2 2.489,0
2X09 = drill 1.016 octagon: 1 -10.16,-1.27; 2 -10.16,1.27; 3 -7.62,-1.27; 4 -7.62,1.27; 5 -5.08,-1.27; 6 -5.08,1.27; 7 -2.54,-1.27; 8 -2.54,1.27; 9 0,-1.27; 10 0,1.27; 11 2.54,-1.27; 12 2.54,1.27; 13 5.08,-1.27; 14 5.08,1.27; 15 7.62,-1.27; 16 7.62,1.27; 17 10.16,-1.27; 18 10.16,1.27
2X04 = drill 1.016 octagon: 1 -3.81,-1.27; 2 -3.81,1.27; 3 -1.27,-1.27; 4 -1.27,1.27; 5 1.27,-1.27; 6 1.27,1.27; 7 3.81,-1.27; 8 3.81,1.27
R0603 = smd 1 x 1.1: 1 -0.85,0; 2 0.85,0
DFN8_3X3MC_MCH-M = smd 0.965 x 0.305: 1 -1.422,0.975; 2 -1.422,0.325; 3 -1.422,-0.325; 4 -1.422,-0.975; 5 1.422,-0.975; 6 1.422,-0.325; 7 1.422,0.325; 8 1.422,0.975 | smd 1.6 x 2.413: 9 0,0
SOT89-5_DIO-M = smd 0.583 x 1.24: 1 -1.5,-1.915; 3 1.5,-1.915; 4 1.5,1.915; 5 -1.5,1.915 | smd 0.66 x 1.24: 2 0,-1.915
TSSOP-16 = smd 1.473 x 0.356: 1 -2.819,2.656; 2 -2.819,1.996; 3 -2.819,1.335; 4 -2.819,0.7; 5 -2.819,0.04; 6 -2.819,-0.595; 7 -2.819,-1.256; 8 -2.819,-1.916; 9 2.819,-1.916; 10 2.819,-1.256; 11 2.819,-0.595; 12 2.819,0.04; 13 2.819,0.7; 14 2.819,1.335; 15 2.819,1.996; 16 2.819,2.656
125SH-G-03-TR-SMT = smd 0.8 x 1.9: 1 1.25,0; 2 0,0; 3 -1.25,0 | smd 1.3 x 3.35: SH1 4.1,-4.875; SH2 -4.1,-4.875
XTAL_ECS-240-8-33-AGN-TR = smd 1.3 x 1.1: 1 -1.15,-0.9; 2 1.15,-0.9; 3 1.15,0.9; 4 -1.15,0.9

### Placement (x,y rotation side)
C1  21.26,43.03 180 top
C2  24.76,43.04 0 top
C3  12.49,40.88 0 top
C4  13.48,39.24 0 top
C5  4,33 270 top
C6  7.49,62.75 0 top
C7  12.9,66.52 0 top
C8  12.9,67.99 0 top
C9  17.39,62.95 270 top
C10  21.37,23.54 180 top
C11  24.88,23.52 0 top
C12  21.32,62.24 180 top
C13  24.85,62.22 0 top
IC1  7.5,38 90 top
J2  9.04,73.66 180 top
J3  33,13 90 top
J4  33,23 90 top
J5  33,33 90 top
J6  33,43 90 top
J7  33,53 90 top
J8  33,63 90 top
J9  27.27,69.33 180 top
JP1  6.5,18 270 top
JP2  6.5,52 90 top
R1  18.21,33.64 0 top
R2  18.19,36.18 0 top
R3  18.17,38.42 0 top
R4  18.19,31.09 0 top
R5  23,31.8 180 top
R6  22.78,45 180 top
R7  4,45 90 top
R8  2,45 90 top
R9  18,14 0 top
R10  18,16.56 0 top
R11  18,19.11 0 top
R12  18,11.44 0 top
R13  23,12 180 top
R14  23.07,25.2 180 top
R15  17.51,52.88 0 top
R16  17.51,55.45 0 top
R17  17.5,58.01 0 top
R18  17.5,50.32 0 top
R19  23,50.5 180 top
R20  23.02,63.87 180 top
U1  6.5,65.5 90 top
U2  13.63,62.92 0 top
U$1  23.32,37.6 90 top
U$2  17.11,69.39 180 top
U$3  23.32,18 90 top
U$4  23.32,56.5 90 top
Y1  7.49,32.35 0 top

### Tracks (layer width: path | path; a pad name or v marks a point on that pad's centre or on a via)
3V3  (via drill 0.35)
  Top 0.203: v4.38,35.12 4.8,35.55 IC1.1 | IC1.17 9.25,40.77 v10.19,40.77 11.53,40.77 C3.1 | C4.1 v11.5,39.25 IC1.15 | U$1.13 22.62,42.52 22.11,42.98 | R6.2 22.11,44.82 | U1.5 8.01,66.92 10.1,64.83 U2.5 12.05,64.92 C7.1 C8.1 | R14.2 C10.1 22.22,22.5 22.62,22.1 U$3.13 | R20.2 C12.1 22.17,61.34 22.62,60.89 U$4.13
  Top 0.305: 22.11,42.98 C1.1 22.11,44.82 | C5.1 4,34.75 v4.38,35.12 | R20.2 v20.98,63.87 v20.97,63.86 | R14.2 21,26.42 v21,27 | v21.85,46.26 21.93,46.18 R6.2
  Top 0.508: C3.1 11.64,42.64 14,45 R6.2
  Bottom 0.305: v20.97,63.86 19.3,63.86 18.02,62.58 18.02,61.65 15.2,58.83 10.68,58.83 | v10.02,59.49 10.68,58.83 | 10.63,58.78 10.2,58.35 10.02,58.35 | 10.68,58.83 10.63,58.78 | 10.63,58.78 10.02,58.78 | v21,27 19.69,28.31 19.69,39.47 21.79,41.57 21.79,46.2 v21.85,46.26
  Bottom 0.508: v10.19,40.77 10.46,40.5 10.46,40.29 10.48,40.27 | v10.19,40.77 9.86,40.77 9.36,40.27 | 9.36,40.27 6.29,40.27 5.46,39.44 5.46,36.2 v4.38,35.12 5.22,34.28 5.22,33.39 7.77,30.84 JP1.2 JP1.4 | v11.5,39.25 10.48,40.27 | 10.48,40.27 9.36,40.27 | v10.19,40.77 10.02,40.94
  Bottom 0.762: 10.02,61.31 v10.02,59.49 10.02,58.78 10.02,58.35 10.02,51.3 | 10.02,51.3 10.02,50.16 | 10.02,50.16 10.02,48.75 | 10.02,48.75 10.02,47.64 | 10.02,47.64 10.02,40.94 | 9.45,50.73 10.02,51.3 | JP2.3 9.45,50.73 | 9.45,50.73 10.02,50.16 | 10.02,48.75 9.46,48.19 JP2.1 9.47,48.19 10.02,47.64
  other vias: 10.02,60.39 10.01,61.34 10.59,43.87 11.48,43.87 11.48,42.94 10.58,42.95
  pour Top (no thermals): 12.35,65.36 10.12,65.36 9.56,64.8 9.56,59.26 9.73,59.09 10.33,59.09 10.47,59.23 10.47,63.92 10.86,64.31 12.35,64.31
  pour Bottom: 10.36,61.79 10.45,61.7 10.45,59.21 10.12,58.88 9.92,58.88 9.59,59.21 9.57,59.23 9.57,61.62 9.74,61.79 10.01,61.79
  pour Top: 10.02,42.53 10.02,43.93 10.3,44.21 11.65,44.21 12.07,43.78 12.55,43.78 12.55,43.35 11.79,42.59 11.79,42.12 11.53,42.12 11.3,42.35 10.2,42.35
  pour Bottom: 10.13,44.7 10.61,44.22 11.44,44.22 11.76,43.9 11.76,43.46 11.76,42.63 11.51,42.38 11.49,42.36 10.57,42.36 10.09,41.88 9.92,41.88 9.92,44.71 10.1,44.71 10.11,44.72
5V  (via drill 0.35)
  Top 0.203: U1.3 6.83,62.94 C6.1 6.64,61.74 v6.48,61.58 | v15.35,62.91 15.35,63.62 | 15.35,63.62 15.35,64.01 | 15.35,64.01 15.35,64.61 U2.4 | C9.1 15.56,63.8 | 15.56,63.8 15.35,64.01 | 15.56,63.8 15.53,63.8 15.35,63.62 | U2.1 v12.13,62.25
  Top 0.762: v6.48,61.58 5.89,60.99 5.89,57.94 7.77,56.06 JP2.7 JP2.5
  Bottom 0.762: v6.48,61.58 8.11,61.58 9.24,62.71 11.67,62.71 11.87,62.91 | 11.87,62.91 v15.35,62.91 15.35,63.03 v15.92,63.6 | v12.13,62.25 12.13,62.65 11.87,62.91
  pour Top (no thermals): 27.91,70 26.66,70 26.62,69.96 26.62,68.73 24.77,66.88 16.19,66.88 14.91,65.6 14.91,62.84 15.16,62.59 15.71,62.59 15.99,62.87 15.99,64.81 16.97,65.79 25.22,65.79 27.96,68.53 27.96,69.95
AGND  (via drill 0.35)
  Top 0.152: J5.1 30.09,31.12 v29.27,30.3 | J8.1 30.11,61.12 v29.34,60.36 | J4.1 30.14,21.12 v29.34,20.33
  Top 0.203: 23.28,32.37 R5.1 23.88,31.77 v25.04,31.77 | v26.59,44.06 26.59,44.02 C2.2 | U$1.5 23.28,35.78 v24,36.5 | U$4.8 25.68,54.12 v26.18,54.12 | J7.1 30.16,51.12 v29.35,50.32 | C13.2 26.25,62.77 v26.86,62.77 | J6.1 30.07,41.12 v29.38,40.43 | U$1.8 25.52,34.5 v26,34.5 | U$3.8 26.25,15.18 v26.28,15.21 | J3.1 30.16,11.12 v29.3,10.26 | R13.1 23.28,12.57 U$3.5 23.28,16.36 v23.84,16.92 | R19.1 23.28,51.07 U$4.5 23.28,54.97 v23.78,55.47
  Top 0.254: U$1.5 23.28,32.37
  other vias: 26.04,31.77 27.04,31.77 25.04,30.77 26.04,30.77 27.04,30.77 24,37.5 24,38.5 25,38.5 25,37.5 25,36.5 33.09,8.76 34.72,8.74 33.1,17.24 34.65,17.28 33.11,18.77 34.7,18.75 33.08,27.3 34.72,27.3 33.04,28.76 34.72,28.77 33.15,37.21 34.55,37.22 33.11,38.7 34.58,38.71 33.17,47.25 34.45,47.23 33.15,48.74 34.45,48.75 33.16,57.22 34.49,57.21 34.49,58.73 33.14,58.75 33.15,67.22 34.42,67.25 23.85,17.95 23.84,18.98 24.92,19.01 24.91,17.98 24.9,16.92 23.78,57.47 23.78,56.47 24.84,57.48 24.85,56.48 24.86,55.46 25.15,12.09 26.23,12.1 26.26,11.06 25.16,11.05 25.16,9.97 26.28,9.98 25.28,50.57 26.38,50.53 26.39,49.47 25.31,49.45 25.3,48.33 26.44,48.33 30.38,50.03 30.36,39.91 30.3,29.78 30.34,59.9 30.38,9.85 30.29,19.74 29.4,1.32
  pour Top: 24,-2 24,63.5 24.5,64 27,64 37,74 39,74 39,-1 38,-2
  pour Route15: 24,-2 24,63.5 24.5,64 27,64 37,74 39,74 39,-0.32 37.32,-2
  pour Route2: 24,-2 24,63.5 24.5,64 27,64 37,74 39,74 39,0.41 36.59,-2
  pour Bottom: 24,-2 24,63.5 24.5,64 27,64 37,74 39,74 39,1.3 35.7,-2
AIN0_0
  Top 0.203: U$4.11 23.91,60.26 24.64,60.98 26.4,60.98 28.23,62.81 28.23,63.84 29.27,64.88 J8.4
AIN0_1
  Top 0.203: U$1.11 23.91,41.3 24.62,42 26.46,42 29.34,44.88 J6.4
AIN0_2
  Top 0.203: U$3.11 23.91,21.64 24.81,22.53 26.6,22.53 28.95,24.88 J4.4
AIN1_0
  Top 0.203: U$4.10 24.58,60.12 24.87,60.41 26.59,60.41 28.74,62.56 28.74,62.86 29.5,63.62 J8.3
AIN1_1
  Top 0.203: U$1.10 24.58,41.08 24.98,41.48 27.08,41.48 29.23,43.62 J6.3
AIN1_2
  Top 0.203: U$3.10 24.58,21.59 24.96,21.97 25.94,21.97 25.97,21.94 26.97,21.94 28.66,23.62 J4.3
AIN2_0
  Top 0.203: U$4.7 24.58,54.32 25.07,54.81 30.66,54.81 J7.4
AIN2_1
  Top 0.203: U$1.7 24.58,35.43 24.96,35.81 29.24,35.81 30.18,34.88 J5.4
AIN2_2
  Top 0.203: U$3.7 24.58,15.83 24.93,16.18 27.18,16.18 28.48,14.88 J3.4
AIN3_0
  Top 0.203: U$4.6 23.91,52.65 24.27,52.29 25.58,52.29 26.91,53.62 J7.3
AIN3_1
  Top 0.203: U$1.6 23.91,33.59 24.25,33.25 28.03,33.25 28.41,33.62 J5.3
AIN3_2
  Top 0.203: U$3.6 23.91,14.03 24.32,13.62 J3.3
AVDD  (via drill 0.35)  (2 unrouted)
  Top 0.203: 23.68,42.81 23.28,42.41 U$1.12 23.28,39.52 23.46,39.34 24.8,39.34 25.26,39.8 | 23.68,42.81 C2.1 | v26.5,37 25.86,37.64 25.86,39.2 25.26,39.8 | 25.26,39.8 25.24,39.82 U$1.9 25.24,40.49 26.94,40.49 28.83,42.38 J6.2 31.95,42.38 32.18,42.14 32.18,32.66 31.89,32.38 J5.2 | 23.63,42.87 23.68,42.81 | J7.2 31.75,52.38 32.14,52.77 32.14,62.08 31.84,62.38 J8.2 29.41,62.38 26.36,59.33 U$4.9 25.24,58.5 25.01,58.27 23.46,58.27 23.28,58.45 U$4.12 23.28,60.44 24,61.16 C13.1 23.87,62.35 R20.1 | J3.2 31.86,12.38 32.05,12.56 32.05,22.2 31.88,22.38 J4.2 28.82,22.38 27.35,20.91 25.33,20.91 U$3.9 25.24,20.15 24.83,19.74 23.46,19.74 23.28,19.92 U$3.12 23.28,21.97 24.03,22.72 C11.1 24.03,25.09 R14.1
  Top 0.305: R6.1 23.63,42.87
  Bottom 0.203: v26.5,37 v26.5,36.99 26.5,36.51
CAN_N
  Top 0.203: U1.6 6.83,67.81 6.68,67.96 6.68,71.36 8.12,72.8 8.6,72.8 8.84,72.56 8.84,72.26 8.41,71.83 J2.2
CAN_P
  Top 0.203: U1.7 6.17,67.81 6.32,67.96 6.32,71.5 7.98,73.17 8.76,73.17 9.2,72.73 9.2,72.26 9.66,71.79 J2.1
CS0  (via drill 0.35)
  Top 0.203: IC1.9 10.68,36.25 10.98,35.95 v11.1,35.95 | v13.44,52.7 13.62,52.88 R15.1
  Bottom 0.203: v11.1,35.95 11.1,37.38 12.74,39.02 12.74,52 v13.44,52.7
CS1
  Top 0.203: IC1.8 9.66,35.55 10,35.21 15.79,35.21 R1.1
CS2
  Top 0.203: IC1.7 8.75,35.12 9.05,34.82 10.67,34.82 14.68,30.81 14.68,17.91 16,16.59 16,15.15 R9.1
DRDY_0
  Top 0.203: IC1.18 8.75,43.61 12.46,47.32 12.46,55.52 18.04,61.1 21.53,61.1 21.98,60.65 U$4.14
DRDY_1
  Top 0.203: IC1.13 10.67,38.25 10.85,38.07 14.65,38.07 18.58,42 21.39,42 21.98,41.41 U$1.14
DRDY_2  (via drill 0.35)
  Top 0.203: U$3.14 21.98,21.89 21.25,22.62 19.5,22.62 v19.5,22.69 | IC1.19 8.25,41.59 7.93,41.91 v7.93,42.61
  Bottom 0.203: v19.5,22.69 19.5,22.02 18.51,21.04 16.45,21.04 13.1,24.4 7.03,24.4 6.43,25 6.43,30.87 2.6,34.7 2.58,34.7 2.58,41.27 3.92,42.61 v7.93,42.61
FDCAN_RX
  Top 0.203: IC1.21 7.25,43.28 11.42,47.45 11.42,55.92 7.47,59.87 U1.4
FDCAN_TX  (via drill 0.35)
  Top 0.203: IC1.22 6.75,43.87 10.52,47.63 10.52,55.66 7.05,59.12 v7.05,59.14 | v5.3,62.62 5.53,62.84 U1.1
  Bottom 0.203: v7.05,59.14 5.3,60.89 v5.3,62.62
GND  (via drill 0.3, 0.35)  (1 unrouted)
  Top 0.203: Y1.2 8.64,30.4 v8.79,30.25 | IC1.16 10.29,39.75 10.63,40.09 12.55,40.09 C3.2 | C4.2 13.56,38.47 10.96,38.47 10.68,38.75 IC1.14 8.75,38.75 v8.5,39 | U1.2 6.17,65.17 U1.9 7,65 8,65 8.34,64.66 C6.2 | C1.2 20.41,43.56 v20.7,43.85 | R4.1 16.05,31.09 v16.03,31.07 | U$1.4 22.62,35.88 v22,36.5 | v6.36,34.06 6.34,34.04 Y1.4 | R13.2 22.62,12.47 U$3.4 22.62,16.6 v22.39,16.83 | R19.2 22.62,50.97 U$4.4 22.62,54.93 v22.33,55.22 | v13.61,59.74 13.61,60.98 U2.2 13.93,61.3 14.13,61.3 14.92,62.1 C9.2
  Top 0.254: U$1.4 22.62,32.27 R5.2
  other vias: 22,37.5 22,38.5 21,37.5 21,36.5 21,38.5 3.99,36.17 6.5,39 8.5,37 6.5,37 14.51,40.68 21.03,31.07 20.38,24.76 20.91,11.54 16.03,11.46 22.42,18 22.41,19.2 21.23,19.24 21.18,18.03 21.14,16.88 21.19,57.64 22.34,57.62 22.32,56.41 21.29,55.29 21.24,56.48 13.06,64.04 14.15,64.02 13.05,65.26 14.15,65.25 19.18,62.2 16.2,61.23 15.13,67.71 15.12,66.74 19.41,69.25 5.75,65.5 7.26,65.49 8.57,64.03 15.55,40.06 25.56,70.7 24.43,70.73 23.26,70.76 23.26,69.7 23.25,68.57 4,31.02 16.44,48.93 15.19,56.64 15.07,54.12 12.16,57.37 14.6,48.86 14.49,46.22 14.49,43.79 13.82,33.85 13.48,30.46 11.46,32.73 12,25.53 9.63,25.61 9.69,23.04 12.04,23.22 14.63,16.12 9.91,16.14 9.81,11.61 14.43,11.56 12.32,9.36 9.82,8.48 1.15,9.33 6.5,1.39 20.76,1.31 21,9.31 15.88,27.52 19.45,26.4 20.9,28.97 19.61,20.69 19.94,12.93 18.02,15.3 18.09,17.86 18.89,32.39 18.87,34.92 19.11,39.97 9.76,28.84 4.34,66.62 3.34,58.62
  pour Top (rank 5): 22,-2 22,64 23,65 26,65 36,75 36,77 -2,77 -3,76 -3,-1 -2,-2
  pour Route15 (rank 5): 22,-2 22,64 23,65 26,65 36,75 36,77 -2,77 -3,76 -3,0.11 -0.89,-2
  pour Top (no thermals): 26.1,69.02 26.1,70.89 25.76,71.23 23.01,71.23 22.64,70.86 22.64,68.44 23.07,68.01 25.09,68.01
  pour Bottom (no thermals): 26.1,69.02 26.1,70.89 25.76,71.23 23.01,71.23 22.64,70.86 22.64,68.44 23.07,68.01 25.09,68.01
  pour Route2 (rank 5): 22,-2 22,64 23,65 26,65 36,75 36,77 -2,77 -3,76 -3,1.41 0.41,-2
  pour Bottom (rank 5): 22,-2 22,64 23,65 26,65 36,75 36,77 -2,77 -3,76 -3,2.47 1.47,-2
GPIO0_SCL
  Top 0.203: IC1.31 4.38,36.75 4.27,36.85 3.64,36.85 3.15,36.36 3.15,25.16 JP1.5
GPIO1_SDA
  Top 0.203: IC1.30 3.44,37.25 2.71,36.52 2.71,23.06 JP1.7
GPIO2
  Top 0.203: IC1.29 3.38,37.75 2.29,36.66 2.29,20.94 JP1.9
GPIO3
  Top 0.203: IC1.28 3.22,38.25 1.88,36.91 1.88,18.81 JP1.11
GPIO4_RX
  Top 0.203: IC1.27 3.05,38.75 1.48,37.18 1.48,16.67 JP1.13
GPIO5_TX
  Top 0.203: IC1.26 2.95,39.25 1.12,37.42 1.12,14.49 JP1.15
GPIO6
  Top 0.203: IC1.25 2.77,39.75 0.64,37.62 0.64,12.43 JP1.17
GPIO7_ADC1
  Top 0.203: IC1.5 7.75,34.65 8.33,34.07 9.57,34.07 9.99,33.65 9.99,30.18 9.21,29.4 6.47,29.4 JP1.1
GPIO8_ADC2
  Top 0.203: IC1.6 8.25,34.78 8.59,34.44 10.21,34.44 10.72,33.93 10.72,28.68 8.98,26.94 6.55,26.94 JP1.3
MISO  (via drill 0.35)
  Top 0.203: IC1.11 11.91,37.25 12.33,36.83 v12.35,36.83 | U$1.15 21.32,41.17 20.95,41.54 20,41.54 | 19.57,41.54 18.8,41.54 14.59,37.33 v14.2,37.33 | 19.57,41.54 20,41.54 | 20,41.54 19.75,41.29 v19.75,40.79 19.75,41.36 19.57,41.54 | v19.47,60.26 19.88,60.67 20.69,60.67 21.32,60.04 U$4.15 | v17.9,22.02 v17.91,22.01 21.03,22.01 21.32,21.72 U$3.15
  Bottom 0.203: v14.2,37.33 13.52,37.33 13.02,36.83 v12.35,36.83 12.35,26.65 16.98,22.02 v17.9,22.02 | v19.75,40.79 19,41.54 19,59.79 v19.47,60.26
MOSI  (via drill 0.35)
  Top 0.203: IC1.12 10.6,37.75 10.68,37.66 12.73,37.66 14,36.39 15.38,36.39 17.32,38.33 R3.1 18.14,39.24 v18.14,39.65 | v16.65,56.78 R17.1 | R11.1 17,19.26 17,25 v18,26
  Bottom 0.203: v16.65,56.78 18.14,55.29 v18.14,39.65 18.14,26.14 v18,26
N$1
  Top 0.203: U$3.16 20.66,19.9 19.87,19.11 R11.2
N$2
  Top 0.203: R10.2 20.31,16.56 20.66,16.21 U$3.1
N$3
  Top 0.203: 20.63,40.38 20.63,39.4 19.65,38.42 R3.2
  Top 0.305: U$1.16 20.63,40.38
N$4
  Top 0.203: U$1.1 20.62,34.83 20.62,35.76 20.2,36.18 R2.2
N$5
  Top 0.203: U$1.2 21.32,34.11 20.74,33.53 19.17,33.53
  Top 0.305: 19.17,33.53 R1.2
N$6
  Top 0.203: U$3.2 21.32,14.28 20.94,13.9 18.95,13.9 R9.2
N$7
  Top 0.203: U$1.3 21.96,34.76 21.96,33.28 19.77,31.09 R4.2
N$8
  Top 0.203: U$3.3 21.98,13.69 19.74,11.44 R12.2
N$9
  Top 0.203: U$4.16 20.66,58.36 20.31,58.01 R17.2
N$10
  Top 0.203: R16.2 20.19,55.45 20.66,54.98 U$4.1
N$11
  Top 0.203: U$4.2 21.32,52.82 21.12,52.62 18.62,52.62 R15.2
N$17
  Top 0.203: U$4.3 21.98,52.72 21.52,52.25 20.28,52.25 R18.2
OSC_IN
  Top 0.203: IC1.2 6.25,35.09 5.42,34.26 5.42,31.82 5.79,31.45 Y1.1
OSC_OUT
  Top 0.203: IC1.3 6.75,35.02 8.22,33.55 8.22,33.25 Y1.3
SCK  (via drill 0.35)
  Top 0.203: IC1.10 11.38,36.75 12.36,35.77 16.93,35.77 R2.1 v17.34,34.97 | v16.63,26.06 15.65,25.08 15.65,18.06 R10.1 | v16.66,54.17 R16.1
  Bottom 0.203: v16.63,26.06 17.34,26.77 v17.34,34.97 17.34,53.49 v16.66,54.17
SWCLK
  Top 0.203: IC1.24 5.75,41.64 4.58,42.81 2.49,42.81 2,43.3 R8.1
SWCLK_C  (via drill 0.35)
  Top 0.203: R8.2 0.65,47.2 0.65,66.04 v4.9,70.29 | v13.61,71.08 15.46,71.08 15.86,70.68 U$2.1
  Bottom 0.203: v4.9,70.29 12.82,70.29 v13.61,71.08
SWDIO
  Top 0.203: IC1.23 6.25,42.94 5.04,44.15 R7.1
SWDIO_C  (via drill 0.35)
  Top 0.203: R7.2 1.22,48.63 1.22,65.23 v4.99,69 v5,69 | v15.71,71.87 16.18,71.87 17.11,70.94 U$2.2
  Bottom 0.203: v5,69 5.47,69.47 13.31,69.47 v15.71,71.87

### Text on the board
tPlace: U$2 | L | 5V | GND | AIN1 / AIN2 / AVDD / AGND | AIN1 / AIN2 / AVDD / AGND | GND | 5v / 5v / 3v3 / 3v3 | AIN1 / AIN2 / AVDD / AGND | AIN1 / AIN2 / AVDD / AGND | 3v3 / 3v3 | AIN1 / AIN2 / AVDD / AGND | A1 / A2 / SCL / SDA / IO2 / IO3 / RX / TX / IO6 | GND | AIN1 / AIN2 / AVDD / AGND | RoboDesignLab / Six-Loacell CAN Interface
bPlace: GND / DIO / CLK | 5v / GND | CAN_H / CAN_L | 6 | AIN1 / AIN2 / AVDD / AGND | 5 | AIN1 / AIN2 / AVDD / AGND | GND | 5v / 5v / 3v3 / 3v3 | 4 | AIN1 / AIN2 / AVDD / AGND | LoadCells | 3 | AIN1 / AIN2 / AVDD / AGND | 3v3 / 3v3 | 2 | AIN1 / AIN2 / AVDD / AGND | A1 / A2 / SCL / SDA / IO2 / IO3 / RX / TX / IO6 | GND | 1 | AIN1 / AIN2 / AVDD / AGND